# Altium project BCM_ECU.PrjPcb (part 1 of 3)
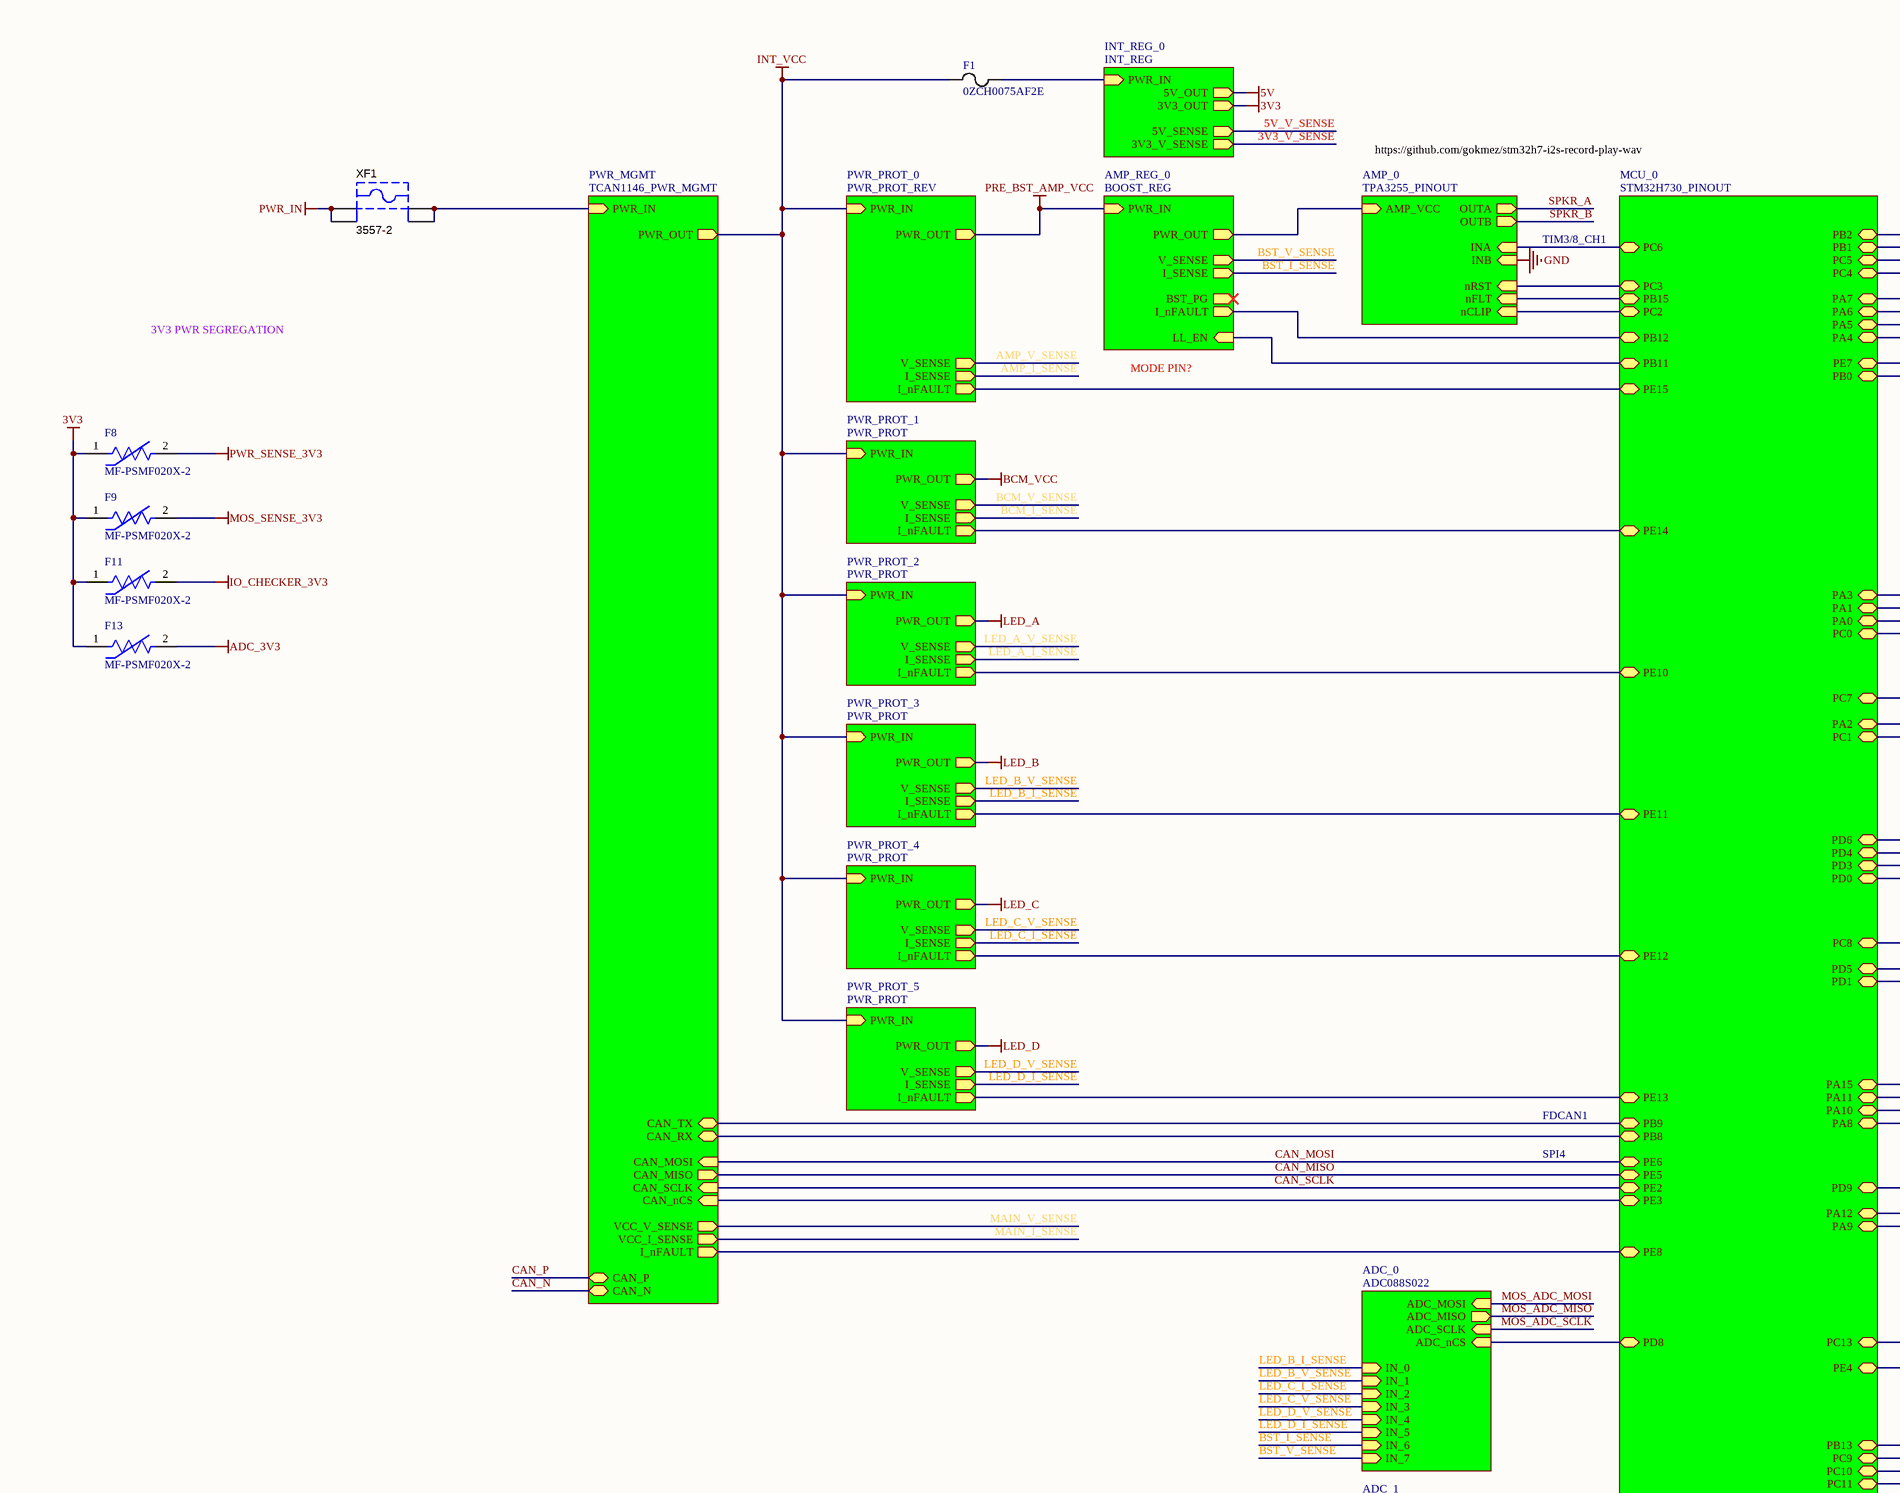
[diagram p0: BCM_ECU.SchDoc, top left]
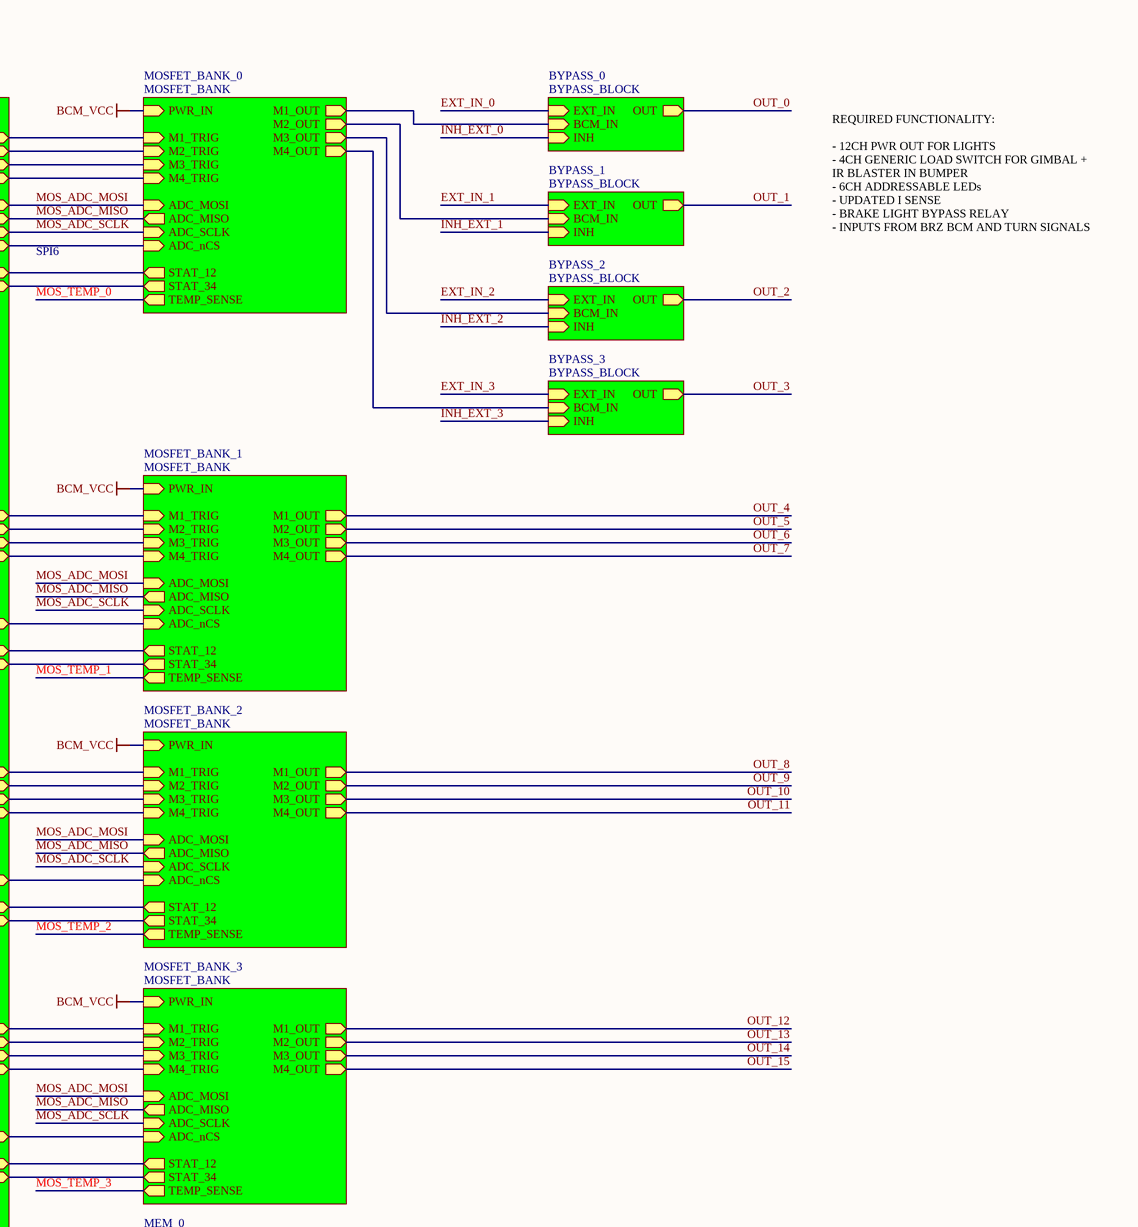
[diagram p1: BCM_ECU.SchDoc, top right]
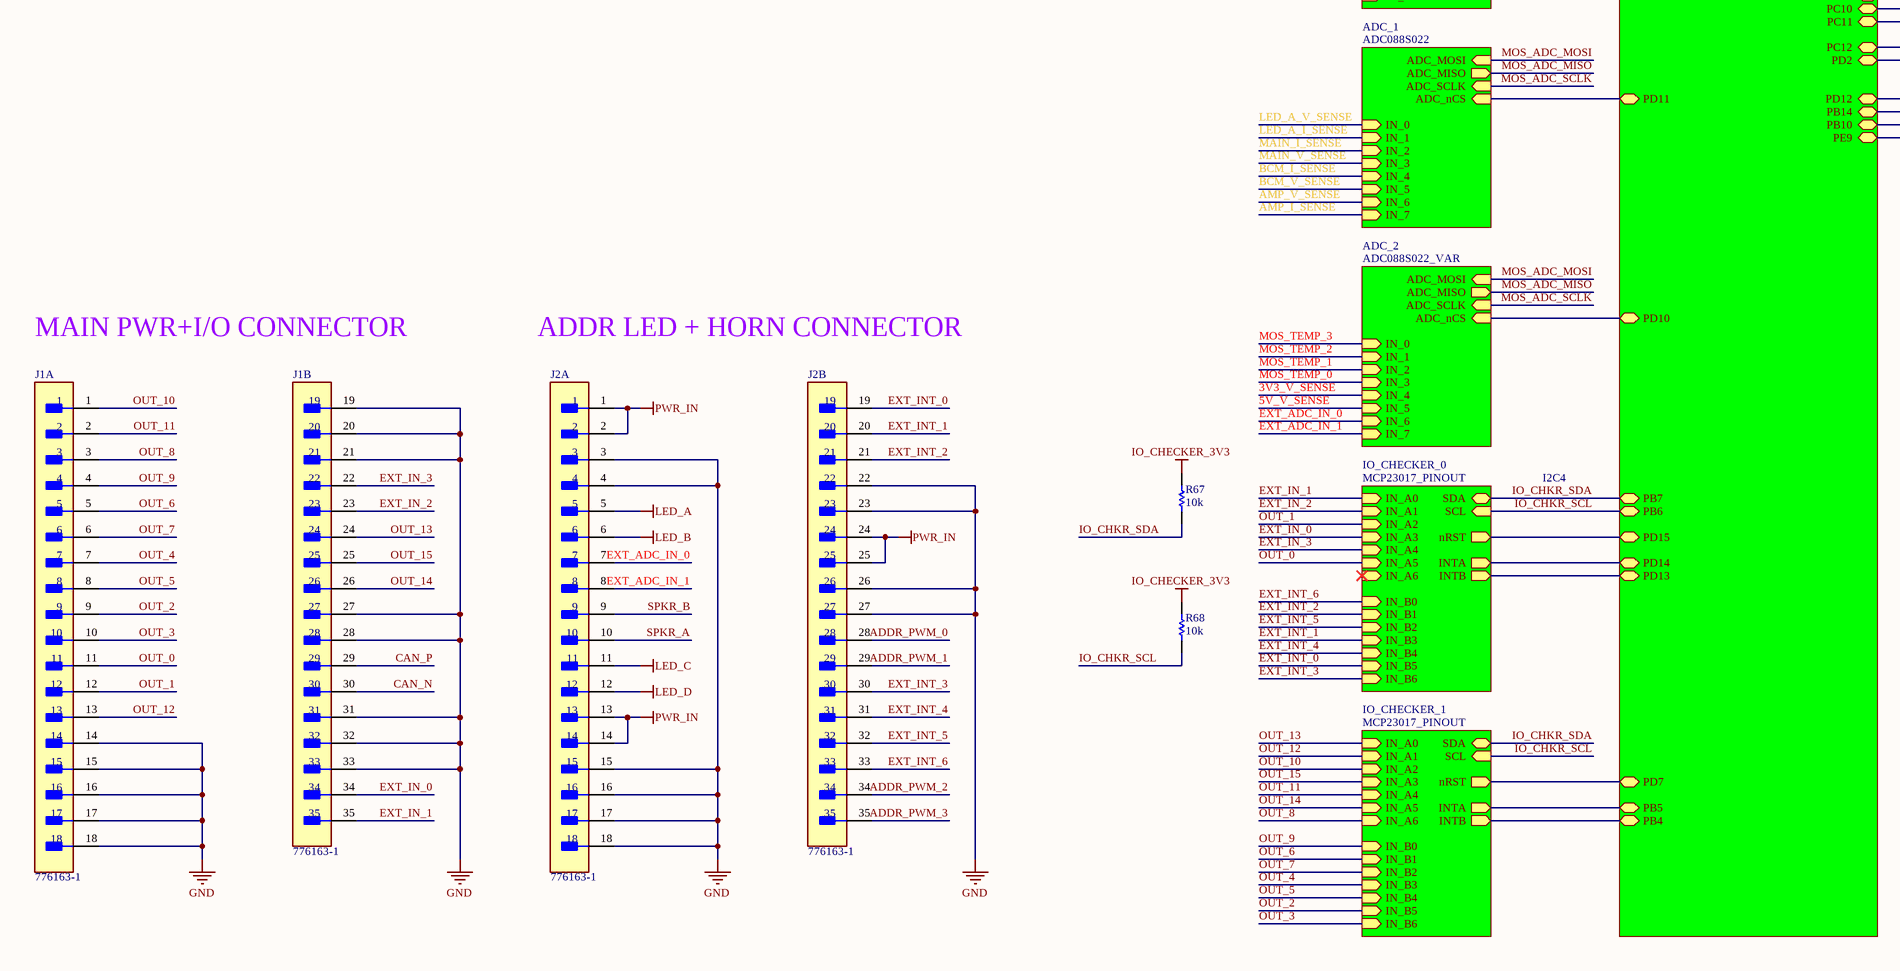
[diagram p2: BCM_ECU.SchDoc, bottom left]
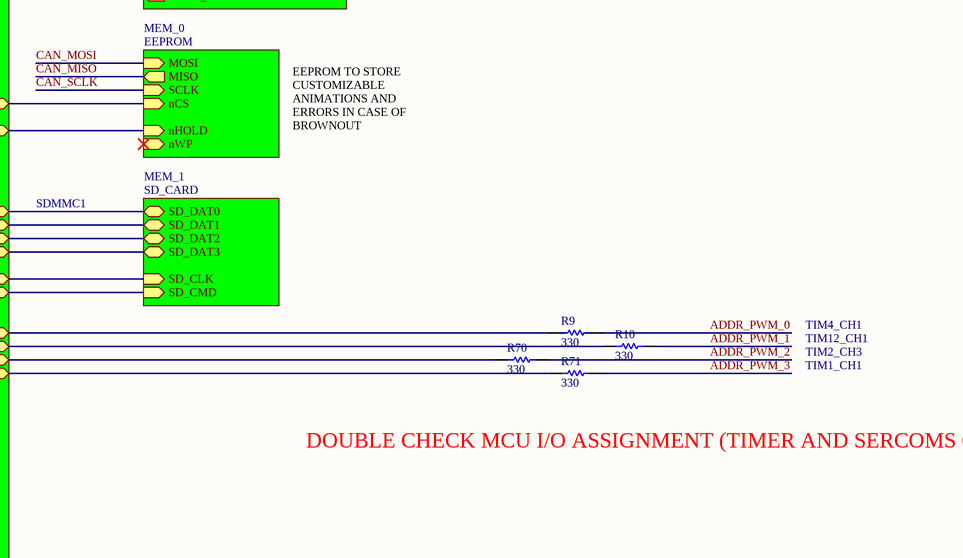
[diagram p3: BCM_ECU.SchDoc, bottom right]
15 sheets, 580 parts. Net scope: hierarchical (ports join the sheet entries above them; power ports are global).
Board files: BCM_ECU_revA.PcbDoc, BCM_ECU_revA_V2.PcbDoc, BCM_ECU_revA_V3.PcbDoc
Sheets:
  BCM_ECU.SchDoc
    MCU_0 = STM32H730_PINOUT.SchDoc
    PWR_MGMT = TCAN1146_PWR_MGMT.SchDoc
    MOSFET_BANK_0 = MOSFET_BANK.SchDoc
    MOSFET_BANK_1 = MOSFET_BANK.SchDoc
    MOSFET_BANK_2 = MOSFET_BANK.SchDoc
    ADC_0 = ADC088S022.SchDoc
    BYPASS_0 = BYPASS_BLOCK.SchDoc
    MOSFET_BANK_3 = MOSFET_BANK.SchDoc
    BYPASS_1 = BYPASS_BLOCK.SchDoc
    BYPASS_2 = BYPASS_BLOCK.SchDoc
    BYPASS_3 = BYPASS_BLOCK.SchDoc
    AMP_REG_0 = BOOST_REG.SchDoc
    INT_REG_0 = INT_REG.SchDoc
    MEM_0 = EEPROM.SchDoc
    PWR_PROT_0 = PWR_PROT_REV.SchDoc
    PWR_PROT_1 = PWR_PROT.SchDoc
    PWR_PROT_2 = PWR_PROT.SchDoc
    PWR_PROT_3 = PWR_PROT.SchDoc
    PWR_PROT_4 = PWR_PROT.SchDoc
    PWR_PROT_5 = PWR_PROT.SchDoc
    ADC_1 = ADC088S022.SchDoc
    IO_CHECKER_0 = MCP23017_PINOUT.SchDoc
    IO_CHECKER_1 = MCP23017_PINOUT.SchDoc
    AMP_0 = TPA3255_PINOUT.SchDoc
    MEM_1 = SD_CARD.SchDoc
    ADC_2 = ADC088S022_VAR.SchDoc

## Sheet BCM_ECU.SchDoc
size D; SheetNumber: 1; SheetTotal: 15

### Parts
F1  0ZCH0075AF2E  [0ZCH0075AF2E-Footprint-1]
F8  MF-PSMF020X-2  [FP-MF-PSMF-MFG]
F9  MF-PSMF020X-2  [FP-MF-PSMF-MFG]
F11  MF-PSMF020X-2  [FP-MF-PSMF-MFG]
F13  MF-PSMF020X-2  [FP-MF-PSMF-MFG]
J1  776163-1  [FP-776163-1-MFG]  (parts A,B of 2)
J2  776163-1  [FP-776163-1-MFG]  (parts A,B of 2)
R9  330  [R0603B]
R10  330  [R0603B]
R67  10k  [R0603B]
R68  10k  [R0603B]
R70  330  [R0603B]
R71  330  [R0603B]
XF1  3557-2  [KSTN-3557-2]

### Sub-sheets
ADC_0 = ADC088S022: IN_0 (in), IN_1 (in), IN_2 (in), IN_3 (in), IN_4 (in), IN_5 (in), IN_6 (in), IN_7 (in), ADC_MOSI (in), ADC_MISO (out), ADC_SCLK (in), ADC_nCS (in)
ADC_1 = ADC088S022: IN_0 (in), IN_1 (in), IN_2 (in), IN_3 (in), IN_4 (in), IN_5 (in), IN_6 (in), IN_7 (in), ADC_MOSI (in), ADC_MISO (out), ADC_SCLK (in), ADC_nCS (in)
ADC_2 = ADC088S022_VAR: IN_0 (in), IN_1 (in), IN_2 (in), IN_3 (in), IN_4 (in), IN_5 (in), IN_6 (in), IN_7 (in), ADC_MOSI (in), ADC_MISO (out), ADC_SCLK (in), ADC_nCS (in)
AMP_0 = TPA3255_PINOUT: INA (in), nRST (in), nCLIP (in), nFLT (in), OUTA (out), OUTB (out), AMP_VCC (in), INB (in)
AMP_REG_0 = BOOST_REG: PWR_IN (in), PWR_OUT (out), I_SENSE (out), V_SENSE (out), I_nFAULT (out), LL_EN (in), BST_PG (out)
BYPASS_0 = BYPASS_BLOCK: EXT_IN (in), OUT (out), INH (in), BCM_IN (in)
BYPASS_1 = BYPASS_BLOCK: EXT_IN (in), OUT (out), INH (in), BCM_IN (in)
BYPASS_2 = BYPASS_BLOCK: EXT_IN (in), OUT (out), INH (in), BCM_IN (in)
BYPASS_3 = BYPASS_BLOCK: EXT_IN (in), OUT (out), INH (in), BCM_IN (in)
INT_REG_0 = INT_REG: PWR_IN (in), 3V3_OUT (out), 3V3_V_SENSE (out), 5V_SENSE (out), 5V_OUT (out)
IO_CHECKER_0 = MCP23017_PINOUT: IN_A0 (in), IN_A1 (in), IN_A2 (in), IN_A3 (in), IN_A4 (in), IN_A5 (in), IN_A6 (in), IN_B0 (in), IN_B1 (in), IN_B2 (in), IN_B3 (in), IN_B4 (in), IN_B5 (in), IN_B6 (in), SDA (bidir), SCL (in), nRST (out), INTA (out), INTB (out)
IO_CHECKER_1 = MCP23017_PINOUT: IN_A0 (in), IN_A1 (in), IN_A2 (in), IN_A3 (in), IN_A4 (in), IN_A5 (in), IN_A6 (in), IN_B0 (in), IN_B1 (in), IN_B2 (in), IN_B3 (in), IN_B4 (in), IN_B5 (in), IN_B6 (in), SDA (bidir), SCL (in), nRST (out), INTA (out), INTB (out)
MCU_0 = STM32H730_PINOUT: PB13 (bidir), PC9 (bidir), PC10 (bidir), PC11 (bidir), PC12 (bidir), PD2 (bidir), PA5 (bidir), PA6 (bidir), PA7 (bidir), PB6 (bidir), PB7 (bidir), PE2 (bidir), PE5 (bidir), PE6 (bidir), PB8 (bidir), PB9 (bidir), PB5 (bidir), PB4 (bidir), PD7 (bidir), PD6 (bidir), PD5 (bidir), PD4 (bidir), PD3 (bidir), PD1 (bidir), PD0 (bidir), PA15 (bidir), PA12 (bidir), PA11 (bidir), PA10 (bidir), PA9 (bidir), PA8 (bidir), PE3 (bidir), PE4 (bidir), PC13 (bidir), PC0 (bidir), PC1 (bidir), PA0 (bidir), PA1 (bidir), PA2 (bidir), PA3 (bidir), PC8 (bidir), PC7 (bidir), PC6 (bidir), PA4 (bidir), PC4 (bidir), PC5 (bidir), PB0 (bidir), PB1 (bidir), PB2 (bidir), PE7 (bidir), PD15 (bidir), PD14 (bidir), PD13 (bidir), PD11 (bidir), PD10 (bidir), PD8 (bidir), PE8 (bidir), PE10 (bidir), PE11 (bidir), PE12 (bidir), PE13 (bidir), PE14 (bidir), PD12 (bidir), PB14 (bidir), PB10 (bidir), PE9 (bidir), PE15 (bidir), PB11 (bidir), PD9 (bidir), PB12 (bidir), PB15 (bidir), PC2 (bidir), PC3 (bidir)
MEM_0 = EEPROM: MOSI (in), MISO (out), SCLK (in), nCS (in), nHOLD (in), nWP (in)
MEM_1 = SD_CARD: SD_DAT0 (bidir), SD_DAT1 (bidir), SD_DAT3 (bidir), SD_DAT2 (bidir), SD_CLK (in), SD_CMD (in)
MOSFET_BANK_0 = MOSFET_BANK: M1_OUT (out), M2_OUT (out), M3_OUT (out), M4_OUT (out), M1_TRIG (in), M2_TRIG (in), M3_TRIG (in), M4_TRIG (in), STAT_12 (out), STAT_34 (out), ADC_MOSI (in), ADC_MISO (out), ADC_SCLK (in), ADC_nCS (in), TEMP_SENSE (out), PWR_IN (in)
MOSFET_BANK_1 = MOSFET_BANK: M1_OUT (out), M2_OUT (out), M3_OUT (out), M4_OUT (out), M1_TRIG (in), M2_TRIG (in), M3_TRIG (in), M4_TRIG (in), STAT_12 (out), STAT_34 (out), ADC_MOSI (in), ADC_MISO (out), ADC_SCLK (in), ADC_nCS (in), TEMP_SENSE (out), PWR_IN (in)
MOSFET_BANK_2 = MOSFET_BANK: M1_OUT (out), M2_OUT (out), M3_OUT (out), M4_OUT (out), M1_TRIG (in), M2_TRIG (in), M3_TRIG (in), M4_TRIG (in), STAT_12 (out), STAT_34 (out), ADC_MOSI (in), ADC_MISO (out), ADC_SCLK (in), ADC_nCS (in), TEMP_SENSE (out), PWR_IN (in)
MOSFET_BANK_3 = MOSFET_BANK: M1_OUT (out), M2_OUT (out), M3_OUT (out), M4_OUT (out), M1_TRIG (in), M2_TRIG (in), M3_TRIG (in), M4_TRIG (in), STAT_12 (out), STAT_34 (out), ADC_MOSI (in), ADC_MISO (out), ADC_SCLK (in), ADC_nCS (in), TEMP_SENSE (out), PWR_IN (in)
PWR_MGMT = TCAN1146_PWR_MGMT: PWR_IN (in), PWR_OUT (out), CAN_TX (bidir), CAN_RX (bidir), CAN_MOSI (in), CAN_MISO (out), CAN_SCLK (in), CAN_nCS (in), VCC_V_SENSE (out), VCC_I_SENSE (out), I_nFAULT (out), CAN_P (bidir), CAN_N (bidir)
PWR_PROT_0 = PWR_PROT_REV: PWR_IN (in), PWR_OUT (out), V_SENSE (out), I_SENSE (out), I_nFAULT (out)
PWR_PROT_1 = PWR_PROT: PWR_IN (in), PWR_OUT (out), V_SENSE (out), I_SENSE (out), I_nFAULT (out)
PWR_PROT_2 = PWR_PROT: PWR_IN (in), PWR_OUT (out), V_SENSE (out), I_SENSE (out), I_nFAULT (out)
PWR_PROT_3 = PWR_PROT: PWR_IN (in), PWR_OUT (out), V_SENSE (out), I_SENSE (out), I_nFAULT (out)
PWR_PROT_4 = PWR_PROT: PWR_IN (in), PWR_OUT (out), V_SENSE (out), I_SENSE (out), I_nFAULT (out)
PWR_PROT_5 = PWR_PROT: PWR_IN (in), PWR_OUT (out), V_SENSE (out), I_SENSE (out), I_nFAULT (out)

### Nets
3V3: F8.1 F9.1 F11.1 F13.1 ; sheet INT_REG_0/3V3_OUT
ADC_3V3: F13.2
BCM_VCC: sheet MOSFET_BANK_0/PWR_IN, sheet MOSFET_BANK_1/PWR_IN, sheet MOSFET_BANK_2/PWR_IN, sheet MOSFET_BANK_3/PWR_IN, sheet PWR_PROT_1/PWR_OUT
GND: J1.14 J1.15 J1.16 J1.17 J1.18 J1.19 J1.20 J1.21 J1.27 J1.28 J1.31 J1.32 J1.33 J2.3 J2.4 J2.15 J2.16 J2.17 J2.18 J2.22 J2.23 J2.26 J2.27 ; sheet AMP_0/INB
INT_VCC: F1.1 ; sheet PWR_MGMT/PWR_OUT, sheet PWR_PROT_0/PWR_IN, sheet PWR_PROT_1/PWR_IN, sheet PWR_PROT_2/PWR_IN, sheet PWR_PROT_3/PWR_IN, sheet PWR_PROT_4/PWR_IN, sheet PWR_PROT_5/PWR_IN  [project net PWR_OUT]
IO_CHECKER_3V3: F11.2 R67.2 R68.2
LED_A: J2.5 ; sheet PWR_PROT_2/PWR_OUT
LED_B: J2.6 ; sheet PWR_PROT_3/PWR_OUT
LED_C: J2.11 ; sheet PWR_PROT_4/PWR_OUT
LED_D: J2.12 ; sheet PWR_PROT_5/PWR_OUT
MOS_SENSE_3V3: F9.2
PRE_BST_AMP_VCC: sheet AMP_REG_0/PWR_IN, sheet PWR_PROT_0/PWR_OUT
PWR_IN: J2.1 J2.2 J2.13 J2.14 J2.24 J2.25 XF1.1 XF1.2
PWR_SENSE_3V3: F8.2
3V3_V_SENSE: sheet INT_REG_0/3V3_V_SENSE, sheet ADC_2/IN_4
5V_V_SENSE: sheet INT_REG_0/5V_SENSE, sheet ADC_2/IN_5
ADC_nCS: sheet MCU_0/PC7, sheet MOSFET_BANK_1/ADC_nCS
ADC_nCS: sheet MCU_0/PC8, sheet MOSFET_BANK_2/ADC_nCS  [a separate net that carries the same name]
ADC_nCS: sheet MCU_0/PA4, sheet MOSFET_BANK_0/ADC_nCS  [a separate net that carries the same name]
ADC_nCS: sheet MCU_0/PD9, sheet MOSFET_BANK_3/ADC_nCS  [a separate net that carries the same name]
ADDR_PWM_0: J2.28 R9.1
ADDR_PWM_1: J2.29 R10.1
ADDR_PWM_2: J2.34 R70.1
ADDR_PWM_3: J2.35 R71.1
AMP_I_SENSE: sheet PWR_PROT_0/I_SENSE, sheet ADC_1/IN_7
AMP_V_SENSE: sheet PWR_PROT_0/V_SENSE, sheet ADC_1/IN_6
AMP_VCC: sheet AMP_REG_0/PWR_OUT, sheet AMP_0/AMP_VCC
BCM_I_SENSE: sheet PWR_PROT_1/I_SENSE, sheet ADC_1/IN_4
BCM_V_SENSE: sheet PWR_PROT_1/V_SENSE, sheet ADC_1/IN_5
BST_I_SENSE: sheet ADC_0/IN_6, sheet AMP_REG_0/I_SENSE
BST_V_SENSE: sheet ADC_0/IN_7, sheet AMP_REG_0/V_SENSE
CAN_MISO: sheet MCU_0/PE5, sheet PWR_MGMT/CAN_MISO, sheet MEM_0/MISO
CAN_MOSI: sheet MCU_0/PE6, sheet PWR_MGMT/CAN_MOSI, sheet MEM_0/MOSI
CAN_N: J1.30 ; sheet PWR_MGMT/CAN_N
CAN_nCS: sheet MCU_0/PE3, sheet PWR_MGMT/CAN_nCS
CAN_P: J1.29 ; sheet PWR_MGMT/CAN_P
CAN_RX: sheet MCU_0/PB8, sheet PWR_MGMT/CAN_RX
CAN_SCLK: sheet MCU_0/PE2, sheet PWR_MGMT/CAN_SCLK, sheet MEM_0/SCLK
CAN_TX: sheet MCU_0/PB9, sheet PWR_MGMT/CAN_TX
EXT_ADC_IN_0: J2.7 ; sheet ADC_2/IN_6
EXT_ADC_IN_1: J2.8 ; sheet ADC_2/IN_7
EXT_IN_0: J1.34 ; sheet BYPASS_0/EXT_IN, sheet IO_CHECKER_0/IN_A3
EXT_IN_1: J1.35 ; sheet BYPASS_1/EXT_IN, sheet IO_CHECKER_0/IN_A0
EXT_IN_2: J1.23 ; sheet BYPASS_2/EXT_IN, sheet IO_CHECKER_0/IN_A1
EXT_IN_3: J1.22 ; sheet BYPASS_3/EXT_IN, sheet IO_CHECKER_0/IN_A4
EXT_INT_0: J2.19 ; sheet IO_CHECKER_0/IN_B5
EXT_INT_1: J2.20 ; sheet IO_CHECKER_0/IN_B3
EXT_INT_2: J2.21 ; sheet IO_CHECKER_0/IN_B1
EXT_INT_3: J2.30 ; sheet IO_CHECKER_0/IN_B6
EXT_INT_4: J2.31 ; sheet IO_CHECKER_0/IN_B4
EXT_INT_5: J2.32 ; sheet IO_CHECKER_0/IN_B2
EXT_INT_6: J2.33 ; sheet IO_CHECKER_0/IN_B0
IO_CHKR_SCL: R68.1 ; sheet MCU_0/PB6, sheet IO_CHECKER_0/SCL, sheet IO_CHECKER_1/SCL
IO_CHKR_SDA: R67.1 ; sheet MCU_0/PB7, sheet IO_CHECKER_0/SDA, sheet IO_CHECKER_1/SDA
LED_A_I_SENSE: sheet PWR_PROT_2/I_SENSE, sheet ADC_1/IN_1
LED_A_V_SENSE: sheet PWR_PROT_2/V_SENSE, sheet ADC_1/IN_0
LED_B_I_SENSE: sheet ADC_0/IN_0, sheet PWR_PROT_3/I_SENSE
LED_B_V_SENSE: sheet ADC_0/IN_1, sheet PWR_PROT_3/V_SENSE
LED_C_I_SENSE: sheet ADC_0/IN_2, sheet PWR_PROT_4/I_SENSE
LED_C_V_SENSE: sheet ADC_0/IN_3, sheet PWR_PROT_4/V_SENSE
LED_D_I_SENSE: sheet ADC_0/IN_5, sheet PWR_PROT_5/I_SENSE
LED_D_V_SENSE: sheet ADC_0/IN_4, sheet PWR_PROT_5/V_SENSE
MAIN_I_SENSE: sheet PWR_MGMT/VCC_I_SENSE, sheet ADC_1/IN_2
MAIN_V_SENSE: sheet PWR_MGMT/VCC_V_SENSE, sheet ADC_1/IN_3
MOS_ADC_MISO: sheet MCU_0/PA6, sheet MOSFET_BANK_0/ADC_MISO, sheet MOSFET_BANK_1/ADC_MISO, sheet MOSFET_BANK_2/ADC_MISO, sheet ADC_0/ADC_MISO, sheet MOSFET_BANK_3/ADC_MISO, sheet ADC_1/ADC_MISO, sheet ADC_2/ADC_MISO  [project net ADC_MISO]
MOS_ADC_MOSI: sheet MCU_0/PA7, sheet MOSFET_BANK_0/ADC_MOSI, sheet MOSFET_BANK_1/ADC_MOSI, sheet MOSFET_BANK_2/ADC_MOSI, sheet ADC_0/ADC_MOSI, sheet MOSFET_BANK_3/ADC_MOSI, sheet ADC_1/ADC_MOSI, sheet ADC_2/ADC_MOSI  [project net ADC_MOSI]
MOS_ADC_SCLK: sheet MCU_0/PA5, sheet MOSFET_BANK_0/ADC_SCLK, sheet MOSFET_BANK_1/ADC_SCLK, sheet MOSFET_BANK_2/ADC_SCLK, sheet ADC_0/ADC_SCLK, sheet MOSFET_BANK_3/ADC_SCLK, sheet ADC_1/ADC_SCLK, sheet ADC_2/ADC_SCLK  [project net ADC_SCLK]
MOS_TEMP_0: sheet MOSFET_BANK_0/TEMP_SENSE, sheet ADC_2/IN_3
MOS_TEMP_1: sheet MOSFET_BANK_1/TEMP_SENSE, sheet ADC_2/IN_2
MOS_TEMP_2: sheet MOSFET_BANK_2/TEMP_SENSE, sheet ADC_2/IN_1
MOS_TEMP_3: sheet MOSFET_BANK_3/TEMP_SENSE, sheet ADC_2/IN_0
OUT_0: J1.11 ; sheet MOSFET_BANK_0/M1_OUT, sheet BYPASS_0/OUT, sheet BYPASS_0/BCM_IN, sheet IO_CHECKER_0/IN_A5
OUT_1: J1.12 ; sheet MOSFET_BANK_0/M2_OUT, sheet BYPASS_1/OUT, sheet BYPASS_1/BCM_IN, sheet IO_CHECKER_0/IN_A2
OUT_2: J1.9 ; sheet MOSFET_BANK_0/M3_OUT, sheet BYPASS_2/OUT, sheet BYPASS_2/BCM_IN, sheet IO_CHECKER_1/IN_B5
OUT_3: J1.10 ; sheet MOSFET_BANK_0/M4_OUT, sheet BYPASS_3/OUT, sheet BYPASS_3/BCM_IN, sheet IO_CHECKER_1/IN_B6
OUT_4: J1.7 ; sheet MOSFET_BANK_1/M1_OUT, sheet IO_CHECKER_1/IN_B3
OUT_5: J1.8 ; sheet MOSFET_BANK_1/M2_OUT, sheet IO_CHECKER_1/IN_B4
OUT_6: J1.5 ; sheet MOSFET_BANK_1/M3_OUT, sheet IO_CHECKER_1/IN_B1
OUT_7: J1.6 ; sheet MOSFET_BANK_1/M4_OUT, sheet IO_CHECKER_1/IN_B2
OUT_8: J1.3 ; sheet MOSFET_BANK_2/M1_OUT, sheet IO_CHECKER_1/IN_A6
OUT_9: J1.4 ; sheet MOSFET_BANK_2/M2_OUT, sheet IO_CHECKER_1/IN_B0
OUT_10: J1.1 ; sheet MOSFET_BANK_2/M3_OUT, sheet IO_CHECKER_1/IN_A2
OUT_11: J1.2 ; sheet MOSFET_BANK_2/M4_OUT, sheet IO_CHECKER_1/IN_A4
OUT_12: J1.13 ; sheet MOSFET_BANK_3/M1_OUT, sheet IO_CHECKER_1/IN_A1
OUT_13: J1.24 ; sheet MOSFET_BANK_3/M2_OUT, sheet IO_CHECKER_1/IN_A0
OUT_14: J1.26 ; sheet MOSFET_BANK_3/M3_OUT, sheet IO_CHECKER_1/IN_A5
OUT_15: J1.25 ; sheet MOSFET_BANK_3/M4_OUT, sheet IO_CHECKER_1/IN_A3
SD_CLK: sheet MCU_0/PC12, sheet MEM_1/SD_CLK
SD_CMD: sheet MCU_0/PD2, sheet MEM_1/SD_CMD
SD_DAT0: sheet MCU_0/PB13, sheet MEM_1/SD_DAT0
SD_DAT1: sheet MCU_0/PC9, sheet MEM_1/SD_DAT1
SD_DAT2: sheet MCU_0/PC10, sheet MEM_1/SD_DAT2
SD_DAT3: sheet MCU_0/PC11, sheet MEM_1/SD_DAT3
SPKR_A: J2.10 ; sheet AMP_0/OUTA
SPKR_B: J2.9 ; sheet AMP_0/OUTB
NetC16_1: F1.2 ; sheet INT_REG_0/PWR_IN
NetC44_2: sheet MCU_0/PC6, sheet AMP_0/INA
NetQ1_5-6-7-8: XF1.3 XF1.4 ; sheet PWR_MGMT/PWR_IN
NetR1_MOSFET_BANK_0_1: sheet MCU_0/PB2, sheet MOSFET_BANK_0/M1_TRIG
NetR1_MOSFET_BANK_1_1: sheet MCU_0/PA3, sheet MOSFET_BANK_1/M1_TRIG
NetR1_MOSFET_BANK_2_1: sheet MCU_0/PD6, sheet MOSFET_BANK_2/M1_TRIG
NetR1_MOSFET_BANK_3_1: sheet MCU_0/PA15, sheet MOSFET_BANK_3/M1_TRIG
NetR2_MOSFET_BANK_0_1: sheet MCU_0/PB1, sheet MOSFET_BANK_0/M2_TRIG
NetR2_MOSFET_BANK_1_1: sheet MCU_0/PA1, sheet MOSFET_BANK_1/M2_TRIG
NetR2_MOSFET_BANK_2_1: sheet MCU_0/PD4, sheet MOSFET_BANK_2/M2_TRIG
NetR2_MOSFET_BANK_3_1: sheet MCU_0/PA11, sheet MOSFET_BANK_3/M2_TRIG
NetR3_MOSFET_BANK_0_1: sheet MCU_0/PC5, sheet MOSFET_BANK_0/M3_TRIG
NetR3_MOSFET_BANK_1_1: sheet MCU_0/PA0, sheet MOSFET_BANK_1/M3_TRIG
NetR3_MOSFET_BANK_2_1: sheet MCU_0/PD3, sheet MOSFET_BANK_2/M3_TRIG
NetR3_MOSFET_BANK_3_1: sheet MCU_0/PA10, sheet MOSFET_BANK_3/M3_TRIG
NetR4_MOSFET_BANK_0_1: sheet MCU_0/PC4, sheet MOSFET_BANK_0/M4_TRIG
NetR4_MOSFET_BANK_1_1: sheet MCU_0/PC0, sheet MOSFET_BANK_1/M4_TRIG
NetR4_MOSFET_BANK_2_1: sheet MCU_0/PD0, sheet MOSFET_BANK_2/M4_TRIG
NetR4_MOSFET_BANK_3_1: sheet MCU_0/PA8, sheet MOSFET_BANK_3/M4_TRIG
NetR5_MOSFET_BANK_0_1: sheet MCU_0/PE7, sheet MOSFET_BANK_0/STAT_12
NetR5_MOSFET_BANK_1_1: sheet MCU_0/PA2, sheet MOSFET_BANK_1/STAT_12
NetR5_MOSFET_BANK_2_1: sheet MCU_0/PD5, sheet MOSFET_BANK_2/STAT_12
NetR5_MOSFET_BANK_3_1: sheet MCU_0/PA12, sheet MOSFET_BANK_3/STAT_12
NetR6_MOSFET_BANK_0_1: sheet MCU_0/PB0, sheet MOSFET_BANK_0/STAT_34
NetR6_MOSFET_BANK_1_1: sheet MCU_0/PC1, sheet MOSFET_BANK_1/STAT_34
NetR6_MOSFET_BANK_2_1: sheet MCU_0/PD1, sheet MOSFET_BANK_2/STAT_34
NetR6_MOSFET_BANK_3_1: sheet MCU_0/PA9, sheet MOSFET_BANK_3/STAT_34
NetR9_2: R9.2 ; sheet MCU_0/PD12
NetR10_2: R10.2 ; sheet MCU_0/PB14
NetR26_1: sheet MCU_0/PE8, sheet PWR_MGMT/I_nFAULT
NetR36_1: sheet MCU_0/PE4, sheet MEM_0/nHOLD
NetR50_PWR_PROT_1_2: sheet MCU_0/PE14, sheet PWR_PROT_1/I_nFAULT
NetR50_PWR_PROT_2_2: sheet MCU_0/PE10, sheet PWR_PROT_2/I_nFAULT
NetR50_PWR_PROT_3_2: sheet MCU_0/PE11, sheet PWR_PROT_3/I_nFAULT
NetR50_PWR_PROT_4_2: sheet MCU_0/PE12, sheet PWR_PROT_4/I_nFAULT
NetR50_PWR_PROT_5_2: sheet MCU_0/PE13, sheet PWR_PROT_5/I_nFAULT
NetR70_2: R70.2 ; sheet MCU_0/PB10
NetR71_2: R71.2 ; sheet MCU_0/PE9
NetR87_2: sheet MCU_0/PB11, sheet AMP_REG_0/LL_EN
NetR88_2: sheet MCU_0/PB12, sheet AMP_REG_0/I_nFAULT
NetR107_2: sheet MCU_0/PE15, sheet PWR_PROT_0/I_nFAULT
NetR121_IO_CHECKER_0_1: sheet MCU_0/PD15, sheet IO_CHECKER_0/nRST
NetR121_IO_CHECKER_1_1: sheet MCU_0/PD7, sheet IO_CHECKER_1/nRST
NetU10_7: sheet MCU_0/PC13, sheet MEM_0/nCS
NetU10_17: sheet MCU_0/PC2, sheet AMP_0/nCLIP
NetU10_18: sheet MCU_0/PC3, sheet AMP_0/nRST
NetU10_54: sheet MCU_0/PB15, sheet AMP_0/nFLT
NetU10_55: sheet MCU_0/PD8, sheet ADC_0/ADC_nCS
NetU10_57: sheet MCU_0/PD10, sheet ADC_2/ADC_nCS
NetU10_58: sheet MCU_0/PD11, sheet ADC_1/ADC_nCS
NetU10_60: sheet MCU_0/PD13, sheet IO_CHECKER_0/INTB
NetU10_61: sheet MCU_0/PD14, sheet IO_CHECKER_0/INTA
NetU10_90: sheet MCU_0/PB4, sheet IO_CHECKER_1/INTB
NetU10_91: sheet MCU_0/PB5, sheet IO_CHECKER_1/INTA

### Notes on the sheet
- https://github.com/gokmez/stm32h7-i2s-record-play-wav
- TIM3/8_CH1
- 3V3 PWR SEGREGATION
- SPI6
- REQUIRED FUNCTIONALITY:
  - 12CH PWR OUT FOR LIGHTS
  - 4CH GENERIC LOAD SWITCH FOR GIMBAL + IR BLASTER IN BUMPER
  - 6CH ADDRESSABLE LEDs
  - UPDATED I SENSE
  - BRAKE LIGHT BYPASS RELAY
  - INPUTS FROM BRZ BCM AND TURN SIGNALS
- MODE PIN?
- FDCAN1
- SPI4
- EEPROM TO STORE CUSTOMIZABLE ANIMATIONS AND ERRORS IN CASE OF BROWNOUT
- SDMMC1
- TIM4_CH1
- TIM12_CH1
- TIM2_CH3
- TIM1_CH1
- DOUBLE CHECK MCU I/O ASSIGNMENT (TIMER AND SERCOMS CORRECT)
- MAIN PWR+I/O CONNECTOR
- ADDR LED + HORN CONNECTOR
- I2C4

### Library data of the parts
F1 = CMP-005-00028-2: PTC Thermistor; RoHS Compliant: Yes
F8 F9 F11 F13 = CMP-07400-000005-1: PTC RESET FUSE 9V 200MA 0805; Manufacturer: Bourns; Trip Current: 0.5A; Resistance: 0.65-3.5Ω; Current Rating: 40A; Value: 0.65-3.5Ω; Trip Time: 0.02s; Hold Current: 0.2A; ComponentLink2Description: Datasheet; Manufacturer Part Number: MF-PSMF020X-2; Height: 0.85mm; Ambient Temperature Range High: +85°C; Category: Fuse; Temperature Range Low: -40°C; ComponentLink2URL: https://www.bourns.com/docs/Product-Datasheets/mfpsmf.pdf; Temperature Range High: +85°C; RoHS: TRUE; Device Class L1: Circuit Protection; Device Class L3: unset; Package: MF-PSMF; Digikey Description: PTC RESET FUSE 9V 200MA 0805; Mouser Description: PTC Resettable Fuse 0.2A(hold) 0.5A(trip) 9V 40A 0.5W 0.02s 0.65Ohm SMD Solder Pad 0805 T/R; Voltage Rating: 9V; Automotive: No; Device Class L2: PTC Resettable Fuses; Temperature: -40°C to +85°C; Lead Free: Yes; Octopart: https://octopart.com/mf-psmf020x-2-bourns-7483437; Ambient Temperature Range Low: -40°C
J1 J2 = CMP-03369-000154-1: CONN HEADER R/A 35POS 4MM; Primary Type: Rectangular; Circuit Application: Power; Tab Thickness: 1.3mm; Number of Signal Positions: 35; Shielding: Unshielded; Pitch: 0.157inch; Max Voltage Rating (AC): 250V; Connector System: Wire-to-Device; Insulation: Insulated; Current Rating: 17A; PCB Thickness: 0.062inch; PCB Mount Retention: With; Gender: Male; Connector Type: Male Pin; PCB Mount Alignment: Yes (With); Series: Ampseal; Depth: 37.9mm; Orientation: Right Angle; Length: 3.03inch; Termination: Solder; Radiation Hardening: No; Number of Rows: 3; Contact Plating: Tin; Lead Free: Lead Free; Flammability Rating: UL94 V-0; Contact Material: Brass; Number of Contacts: 35; ELV: Compliant; Max Operating Temperature: 221°C; Min Operating Temperature: -40°C; Package Quantity: 1; Mount: Through Hole; Contact Type: Male Pin; Housing Material: Thermoplastic; Number of Positions: 35; Packaging: Bulk; Row Spacing: 0.157inch; RoHS Compliant: Yes; Height: 32.1mm; Color: Black; Fastening Type: Ramp; Sealable: Yes (With); Width: 37.9mm
R9 R10 R70 R71 = CMP-009-00002-14: Resistor; Value: 330
R67 R68 = CMP-009-00002-14: Resistor; Value: 100k
XF1 = CMP-2000-05461-1: FUSE HOLDER, PCB MOUNT, 500VAC, 20A, ROHS; Manufacturer: Keystone-Electronics; Number of Circuits: 1; Voltage: 500V; Fuseholder Type: Block; Fuse Type: Blade; Fuse Size: 0.43"Lx0.15"Wx0.64"H(10.92mmx3.81mmx16.25mm); For Use With/Related Products: ATC,ATO257,MINI897; Current Rating: 30A; Datasheet URL: http://datasheet.octopart.com/3557-2-Keystone-datasheet-15715937.pdf; Orientation: Vertical; Family: Fuseholders; Datasheet Version: Apr-13; Contact Finish: TinNickel; Mounting Type: PCB; Series: -; Category: CircuitProtection; Termination Style: PCPin; Contact Material: Brass; Manufacturer URL: http://www.keyelco.com/

## Sheet STM32H730_PINOUT.SchDoc
size C; SheetNumber: 4; SheetTotal: 15
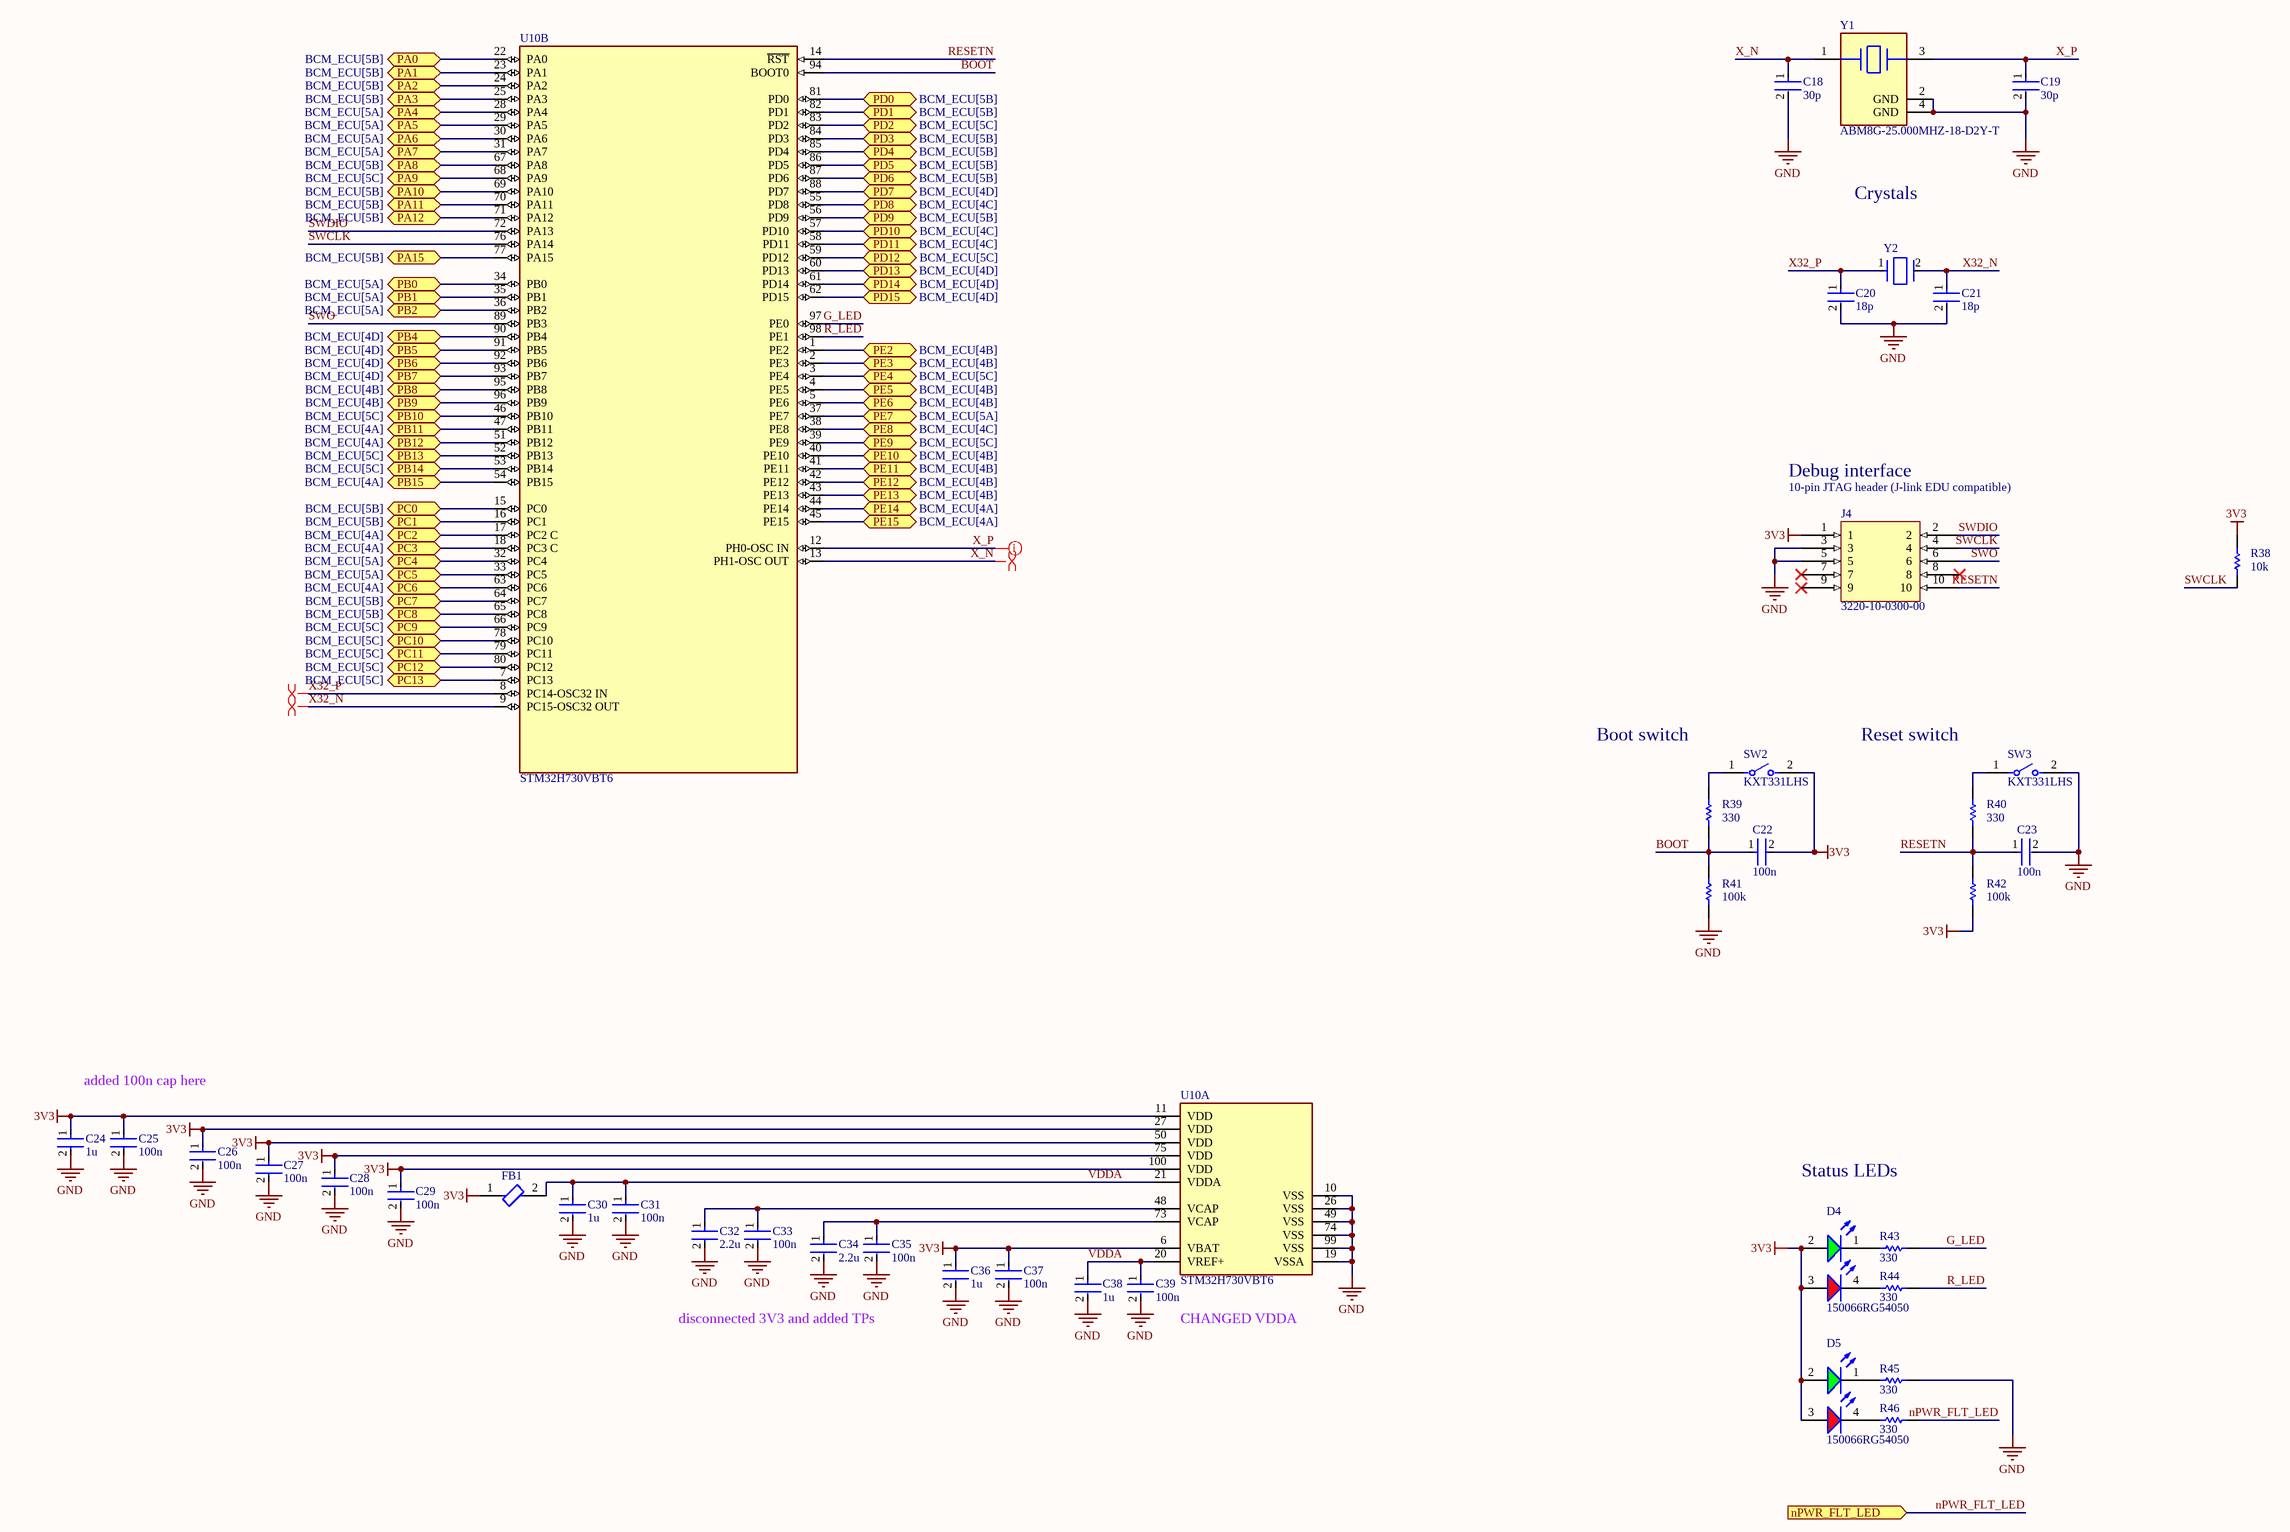
[diagram p4: STM32H730_PINOUT.SchDoc]

### Parts
C18  30p  [FP-0402-L_1_0_0_05-W_0_5-IPC_A]
C19  30p  [FP-0402-L_1_0_0_05-W_0_5-IPC_A]
C20  18p  [FP-0402-L_1_0_0_05-W_0_5-IPC_A]
C21  18p  [FP-0402-L_1_0_0_05-W_0_5-IPC_A]
C22  100n  [FP-0402-L_1_0_0_05-W_0_5-IPC_A]
C23  100n  [FP-0402-L_1_0_0_05-W_0_5-IPC_A]
C24  1u  [FP-0402-L_1_0_0_05-W_0_5-IPC_A]
C25  100n  [FP-0402-L_1_0_0_05-W_0_5-IPC_A]
C26  100n  [FP-0402-L_1_0_0_05-W_0_5-IPC_A]
C27  100n  [FP-0402-L_1_0_0_05-W_0_5-IPC_A]
C28  100n  [FP-0402-L_1_0_0_05-W_0_5-IPC_A]
C29  100n  [FP-0402-L_1_0_0_05-W_0_5-IPC_A]
C30  1u  [FP-0402-L_1_0_0_05-W_0_5-IPC_A]
C31  100n  [FP-0402-L_1_0_0_05-W_0_5-IPC_A]
C32  2.2u  [FP-0402-L_1_0_0_05-W_0_5-IPC_A]
C33  100n  [FP-0402-L_1_0_0_05-W_0_5-IPC_A]
C34  2.2u  [FP-0402-L_1_0_0_05-W_0_5-IPC_A]
C35  100n  [FP-0402-L_1_0_0_05-W_0_5-IPC_A]
C36  1u  [FP-0402-L_1_0_0_05-W_0_5-IPC_A]
C37  100n  [FP-0402-L_1_0_0_05-W_0_5-IPC_A]
C38  1u  [FP-0402-L_1_0_0_05-W_0_5-IPC_A]
C39  100n  [FP-0402-L_1_0_0_05-W_0_5-IPC_A]
D4  150066RG54050  [WL-SBCD_0606]
D5  150066RG54050  [WL-SBCD_0606]
FB1  BLM15PX601SN1D  [FP-BLM15-0_05-IPC_A]  (value not drawn)
J4  3220-10-0300-00  [3220-10-0300-00-Footprint-1]
R38  10k  [R0603B]
R39  330  [R0603B]
R40  330  [R0603B]
R41  100k  [R0603B]
R42  100k  [R0603B]
R43  330  [R0603B]
R44  330  [R0603B]
R45  330  [R0603B]
R46  330  [R0603B]
SW2  KXT331LHS  [FP-KXT331LHS-MFG]
SW3  KXT331LHS  [FP-KXT331LHS-MFG]
U10  STM32H730VBT6  [FP-LQFP100-1L-IPC_C]  (parts A,B of 2)
Y1  ABM8G-25.000MHZ-18-D2Y-T  [FP-ABM8G-MFG]
Y2  ECS-.327-12.5-1210-TR  [FP-ECX-1210-MFG]  (value not drawn)

### Ports
nPWR_FLT_LED (in), PA0 (bidir, see BCM_ECU[5B]), PA1 (bidir, see BCM_ECU[5B]), PA2 (bidir, see BCM_ECU[5B]), PA3 (bidir, see BCM_ECU[5B]), PA4 (bidir, see BCM_ECU[5A]), PA5 (bidir, see BCM_ECU[5A]), PA6 (bidir, see BCM_ECU[5A]), PA7 (bidir, see BCM_ECU[5A]), PA8 (bidir, see BCM_ECU[5B]), PA9 (bidir, see BCM_ECU[5C]), PA10 (bidir, see BCM_ECU[5B]), PA11 (bidir, see BCM_ECU[5B]), PA12 (bidir, see BCM_ECU[5B]), PA15 (bidir, see BCM_ECU[5B]), PB0 (bidir, see BCM_ECU[5A]), PB1 (bidir, see BCM_ECU[5A]), PB2 (bidir, see BCM_ECU[5A]), PB4 (bidir, see BCM_ECU[4D]), PB5 (bidir, see BCM_ECU[4D]), PB6 (bidir, see BCM_ECU[4D]), PB7 (bidir, see BCM_ECU[4D]), PB8 (bidir, see BCM_ECU[4B]), PB9 (bidir, see BCM_ECU[4B]), PB10 (bidir, see BCM_ECU[5C]), PB11 (bidir, see BCM_ECU[4A]), PB12 (bidir, see BCM_ECU[4A]), PB13 (bidir, see BCM_ECU[5C]), PB14 (bidir, see BCM_ECU[5C]), PB15 (bidir, see BCM_ECU[4A]), PC0 (bidir, see BCM_ECU[5B]), PC1 (bidir, see BCM_ECU[5B]), PC2 (bidir, see BCM_ECU[4A]), PC3 (bidir, see BCM_ECU[4A]), PC4 (bidir, see BCM_ECU[5A]), PC5 (bidir, see BCM_ECU[5A]), PC6 (bidir, see BCM_ECU[4A]), PC7 (bidir, see BCM_ECU[5B]), PC8 (bidir, see BCM_ECU[5B]), PC9 (bidir, see BCM_ECU[5C]), PC10 (bidir, see BCM_ECU[5C]), PC11 (bidir, see BCM_ECU[5C]), PC12 (bidir, see BCM_ECU[5C]), PC13 (bidir, see BCM_ECU[5C]), PD0 (bidir, see BCM_ECU[5B]), PD1 (bidir, see BCM_ECU[5B]), PD2 (bidir, see BCM_ECU[5C]), PD3 (bidir, see BCM_ECU[5B]), PD4 (bidir, see BCM_ECU[5B]), PD5 (bidir, see BCM_ECU[5B]), PD6 (bidir, see BCM_ECU[5B]), PD7 (bidir, see BCM_ECU[4D]), PD8 (bidir, see BCM_ECU[4C]), PD9 (bidir, see BCM_ECU[5B]), PD10 (bidir, see BCM_ECU[4C]), PD11 (bidir, see BCM_ECU[4C]), PD12 (bidir, see BCM_ECU[5C]), PD13 (bidir, see BCM_ECU[4D]), PD14 (bidir, see BCM_ECU[4D]), PD15 (bidir, see BCM_ECU[4D]), PE2 (bidir, see BCM_ECU[4B]), PE3 (bidir, see BCM_ECU[4B]), PE4 (bidir, see BCM_ECU[5C]), PE5 (bidir, see BCM_ECU[4B]), PE6 (bidir, see BCM_ECU[4B]), PE7 (bidir, see BCM_ECU[5A]), PE8 (bidir, see BCM_ECU[4C]), PE9 (bidir, see BCM_ECU[5C]), PE10 (bidir, see BCM_ECU[4B]), PE11 (bidir, see BCM_ECU[4B]), PE12 (bidir, see BCM_ECU[4B]), PE13 (bidir, see BCM_ECU[4B]), PE14 (bidir, see BCM_ECU[4A]), PE15 (bidir, see BCM_ECU[4A])

### Nets
3V3: C22.2 C24.1 C25.1 C26.1 C27.1 C28.1 C29.1 C36.1 C37.1 D4.2(A) D4.3(A) D5.2(A) D5.3(A) FB1.1 J4.1 R38.2 R42.1 SW2.2 U10.6(VBAT) U10.11(VDD) U10.27(VDD) U10.50(VDD) U10.75(VDD) U10.100(VDD)
GND: C18.2 C19.2 C20.2 C21.2 C23.2 C24.2 C25.2 C26.2 C27.2 C28.2 C29.2 C30.2 C31.2 C32.2 C33.2 C34.2 C35.2 C36.2 C37.2 C38.2 C39.2 J4.3 J4.5 R41.1 R45.1 SW3.2 U10.10(VSS) U10.19(VSSA) U10.26(VSS) U10.49(VSS) U10.74(VSS) U10.99(VSS) Y1.2(GND) Y1.4(GND)
ADC_MISO: U10.30(PA6) ; port PA6
ADC_MOSI: U10.31(PA7) ; port PA7
ADC_nCS: U10.64(PC7) ; port PC7
ADC_nCS: U10.65(PC8) ; port PC8  [a separate net that carries the same name]
ADC_nCS: U10.28(PA4) ; port PA4  [a separate net that carries the same name]
ADC_nCS: U10.56(PD9) ; port PD9  [a separate net that carries the same name]
ADC_SCLK: U10.29(PA5) ; port PA5
BOOT: C22.1 R39.1 R41.2 U10.94(BOOT0)
CAN_MISO: U10.4(PE5) ; port PE5
CAN_MOSI: U10.5(PE6) ; port PE6
CAN_nCS: U10.2(PE3) ; port PE3
CAN_RX: U10.95(PB8) ; port PB8
CAN_SCLK: U10.1(PE2) ; port PE2
CAN_TX: U10.96(PB9) ; port PB9
G_LED: R43.1 U10.97(PE0)
IO_CHKR_SCL: U10.92(PB6) ; port PB6
IO_CHKR_SDA: U10.93(PB7) ; port PB7
nPWR_FLT_LED: R46.1 ; port nPWR_FLT_LED
R_LED: R44.1 U10.98(PE1)
RESETN: C23.1 J4.10 R40.1 R42.2 U10.14(~{RST})
SD_CLK: U10.80(PC12) ; port PC12
SD_CMD: U10.83(PD2) ; port PD2
SD_DAT0: U10.52(PB13) ; port PB13
SD_DAT1: U10.66(PC9) ; port PC9
SD_DAT2: U10.78(PC10) ; port PC10
SD_DAT3: U10.79(PC11) ; port PC11
SWCLK: J4.4 R38.1 U10.76(PA14)
SWDIO: J4.2 U10.72(PA13)
SWO: J4.6 U10.89(PB3)
VDDA: C30.1 C31.1 C38.1 C39.1 FB1.2 U10.20(VREF+) U10.21(VDDA)
X32_N: C21.1 U10.9(PC15-OSC32_OUT) Y2.2(Out/In)
X32_P: C20.1 U10.8(PC14-OSC32_IN) Y2.1(In/Out)
X_N: C18.1 U10.13(PH1-OSC_OUT) Y1.1
X_P: C19.1 U10.12(PH0-OSC_IN) Y1.3
NetC32_1: C32.1 C33.1 U10.48(VCAP)
NetC34_1: C34.1 C35.1 U10.73(VCAP)
NetC44_2: U10.63(PC6) ; port PC6
NetD4_1: D4.1(K) R43.2
NetD4_4: D4.4(K) R44.2
NetD5_1: D5.1(K) R45.2
NetD5_4: D5.4(K) R46.2
NetR1_MOSFET_BANK_0_1: U10.36(PB2) ; port PB2
NetR1_MOSFET_BANK_1_1: U10.25(PA3) ; port PA3
NetR1_MOSFET_BANK_2_1: U10.87(PD6) ; port PD6
NetR1_MOSFET_BANK_3_1: U10.77(PA15) ; port PA15
NetR2_MOSFET_BANK_0_1: U10.35(PB1) ; port PB1
NetR2_MOSFET_BANK_1_1: U10.23(PA1) ; port PA1
NetR2_MOSFET_BANK_2_1: U10.85(PD4) ; port PD4
NetR2_MOSFET_BANK_3_1: U10.70(PA11) ; port PA11
NetR3_MOSFET_BANK_0_1: U10.33(PC5) ; port PC5
NetR3_MOSFET_BANK_1_1: U10.22(PA0) ; port PA0
NetR3_MOSFET_BANK_2_1: U10.84(PD3) ; port PD3
NetR3_MOSFET_BANK_3_1: U10.69(PA10) ; port PA10
NetR4_MOSFET_BANK_0_1: U10.32(PC4) ; port PC4
NetR4_MOSFET_BANK_1_1: U10.15(PC0) ; port PC0
NetR4_MOSFET_BANK_2_1: U10.81(PD0) ; port PD0
NetR4_MOSFET_BANK_3_1: U10.67(PA8) ; port PA8
NetR5_MOSFET_BANK_0_1: U10.37(PE7) ; port PE7
NetR5_MOSFET_BANK_1_1: U10.24(PA2) ; port PA2
NetR5_MOSFET_BANK_2_1: U10.86(PD5) ; port PD5
NetR5_MOSFET_BANK_3_1: U10.71(PA12) ; port PA12
NetR6_MOSFET_BANK_0_1: U10.34(PB0) ; port PB0
NetR6_MOSFET_BANK_1_1: U10.16(PC1) ; port PC1
NetR6_MOSFET_BANK_2_1: U10.82(PD1) ; port PD1
NetR6_MOSFET_BANK_3_1: U10.68(PA9) ; port PA9
NetR9_2: U10.59(PD12) ; port PD12
NetR10_2: U10.53(PB14) ; port PB14
NetR26_1: U10.38(PE8) ; port PE8
NetR36_1: U10.3(PE4) ; port PE4
NetR39_2: R39.2 SW2.1
NetR40_2: R40.2 SW3.1
NetR50_PWR_PROT_1_2: U10.44(PE14) ; port PE14
NetR50_PWR_PROT_2_2: U10.40(PE10) ; port PE10
NetR50_PWR_PROT_3_2: U10.41(PE11) ; port PE11
NetR50_PWR_PROT_4_2: U10.42(PE12) ; port PE12
NetR50_PWR_PROT_5_2: U10.43(PE13) ; port PE13
NetR70_2: U10.46(PB10) ; port PB10
NetR71_2: U10.39(PE9) ; port PE9
NetR87_2: U10.47(PB11) ; port PB11
NetR88_2: U10.51(PB12) ; port PB12
NetR107_2: U10.45(PE15) ; port PE15
NetR121_IO_CHECKER_0_1: U10.62(PD15) ; port PD15
NetR121_IO_CHECKER_1_1: U10.88(PD7) ; port PD7
NetU10_7: U10.7(PC13) ; port PC13
NetU10_17: U10.17(PC2_C) ; port PC2
NetU10_18: U10.18(PC3_C) ; port PC3
NetU10_54: U10.54(PB15) ; port PB15
NetU10_55: U10.55(PD8) ; port PD8
NetU10_57: U10.57(PD10) ; port PD10
NetU10_58: U10.58(PD11) ; port PD11
NetU10_60: U10.60(PD13) ; port PD13
NetU10_61: U10.61(PD14) ; port PD14
NetU10_90: U10.90(PB4) ; port PB4
NetU10_91: U10.91(PB5) ; port PB5

Not connected (* = marked no-connect by the designer): J4 7* 8* 9*

### Layout directives
differential pair: X32_N, X32_P, X_N, X_P

### Notes on the sheet
- Crystals
- Debug interface
- (near J4) 10-pin JTAG header (J-link EDU compatible)
- Boot switch
- Reset switch
- added 100n cap here
- Status LEDs
- disconnected 3V3 and added TPs
- CHANGED VDDA

### Library data of the parts
C18-C39 = CMP-001-00058-1: LARGE PADS, 0402 CAP, CHANGE COMMENT TO MATCH REAL P/N; Capacitor Type: Ceramic; Min Operating Temperature: -55°C; Mounting Technology: Surface Mount; Pins: 2; Case/Package: 0402; RoHS Compliant: Yes; Max Operating Temperature: 85°C
D4 D5 = CMP-004-00040-2: Led, Red/Grn, 180Mcd/230Mcd, 624Nm/525Nm Rohs Compliant: Yes; Source: rgled.SchLib; Component Type: Standard; Design Item ID: CMP-004-00034-2; Pins: 4
FB1 = CMP-0686-00252-4: Chip Ferrite Bead, 0402, 600Ω @ 100MHz, 0.23Ω, 25%, 900mA; Number of Circuits: 1; Impedance: 600R; DC Resistance (DCR): 230mR; Material: Steel; Length: 1mm; Package Quantity: 10000; Height: 0.5mm; Width: 0.5mm; Max DC Current: 900mA; Number of Lines: 1; Termination: SMD/SMT; Packaging: Tape and Reel; Lead Free: Lead Free; Min Operating Temperature: -55°C; Max Operating Temperature: 125°C; Max Current Rating: 900mA; Case Code (Imperial): 0402; Number of Pins: 2; Current Rating: 900mA; Test Frequency: 100MHz; Case/Package: 0402; Tolerance: 25%; Case Code (Metric): 1005
J4 = CMP-001-0013-3: CONN HEADER SMD 10POS 1.27MM
R38-R40 R43-R46 = CMP-009-00002-14: Resistor
  R38: Value: 10k
  R39 R40 R43-R46: Value: 330
R41 R42 = CMP-009-00002-14: Resistor; Value: 10k
SW2 SW3 = CMP-10040-000029-1: SWITCH TACTILE SPST-NO 0.02A 15V; Operating Force: 240gf; Switch Travel: 0.13mm; Illumination Type: Non-Illuminated; Throw Configuration: SPST; Number of Ports: 1; Current Rating: 5A; Mechanical Life: 500000Cycles; Switch Function: Off-Mom; Connector Type: USB; Actuator Type: Standard; Gender: Receptacle; Number of Contacts: 24; Contact Plating: Gold; Insulation Color: Black; Min Operating Temperature: -40°C; Packaging: Tape and Reel; Flammability Rating: UL94 V-0; Max Operating Temperature: 85°C; Termination: Solder; Mount: Surface Mount
U10 = CMP-12105-000107-1: IC MCU 32BIT 128KB FLASH 100LQFP
Y1 = CMP-2000-05733-3: Crystal 25MHz ±20ppm (Tol) ±30ppm (Stability) 18pF FUND 60Ω 4-Pin SMD T/R; Series Resistance: 60R; Length: 3.2mm; Depth: 2.5mm; Packaging: Tape and Reel; Min Operating Temperature: -40°C; Operating Frequency: 25 MHz; Lead Free: Lead Free; Number of Pins: 4; Frequency Tolerance: 20ppm; Radiation Hardening: No; Max Operating Temperature: 85°C; Termination: SMD/SMT; Frequency Stability: 30ppm; Frequency: 25MHz; Series: ABM8G; Mount: Surface Mount; Package Quantity: 1000; Height: 0.039inch; Width: 0.098inch; Case/Package: CSMD; ESR (Equivalent Series Resistance): 60R; Load Capacitance: 18pF; Tolerance: 20ppm
Y2 = CMP-40224-000006-1: CRYSTAL 32.7680KHZ 12.5PF SMD; Manufacturer: ECS International; Frequency: 32.768kHz; Esr: 90kΩ; Tolerance: 20ppm; Device Class L1: Passive Components; Load Capacitance: 12.5pF; Temperature: -40°C to +85°C; ComponentLink2URL: https://ecsxtal.com/store/pdf/ECX-1210.pdf; Series: ECX-1210; Octopart: https://octopart.com/ecs-.327-12.5-1210-tr-ecs+international-81221340; ComponentLink2Description: Datasheet; Temperature Range Low: -40°C; Digikey Description: CRYSTAL 32.7680KHZ 12.5PF SMD; Lead Free: Yes; RoHS: TRUE; Device Class L3: Crystals; Automotive: No; Category: Crys; Height: 0.5mm; Manufacturer Part Number: ECS-.327-12.5-1210-TR; Temperature Range High: +85°C; Device Class L2: Crystals / Oscillators; Package: ECX-1210

## Sheet TCAN1146_PWR_MGMT.SchDoc
size C; SheetNumber: 3; SheetTotal: 15
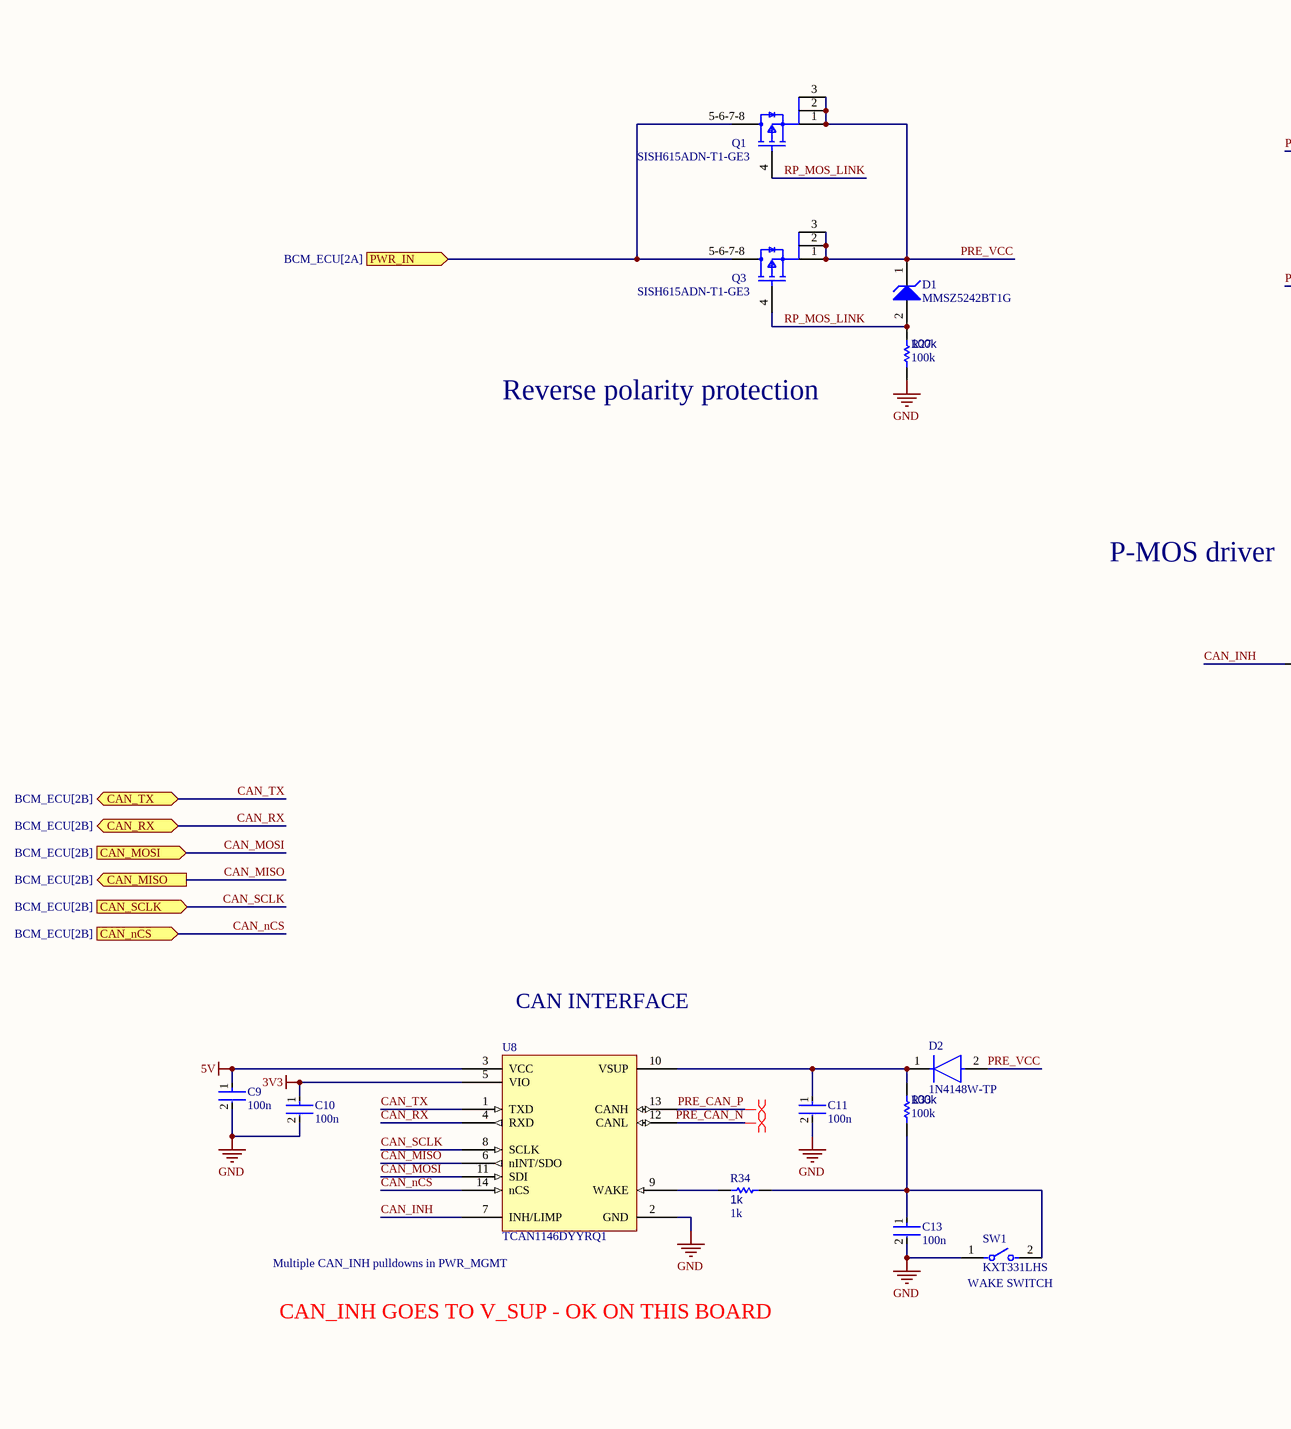
[diagram p5: TCAN1146_PWR_MGMT.SchDoc, left]
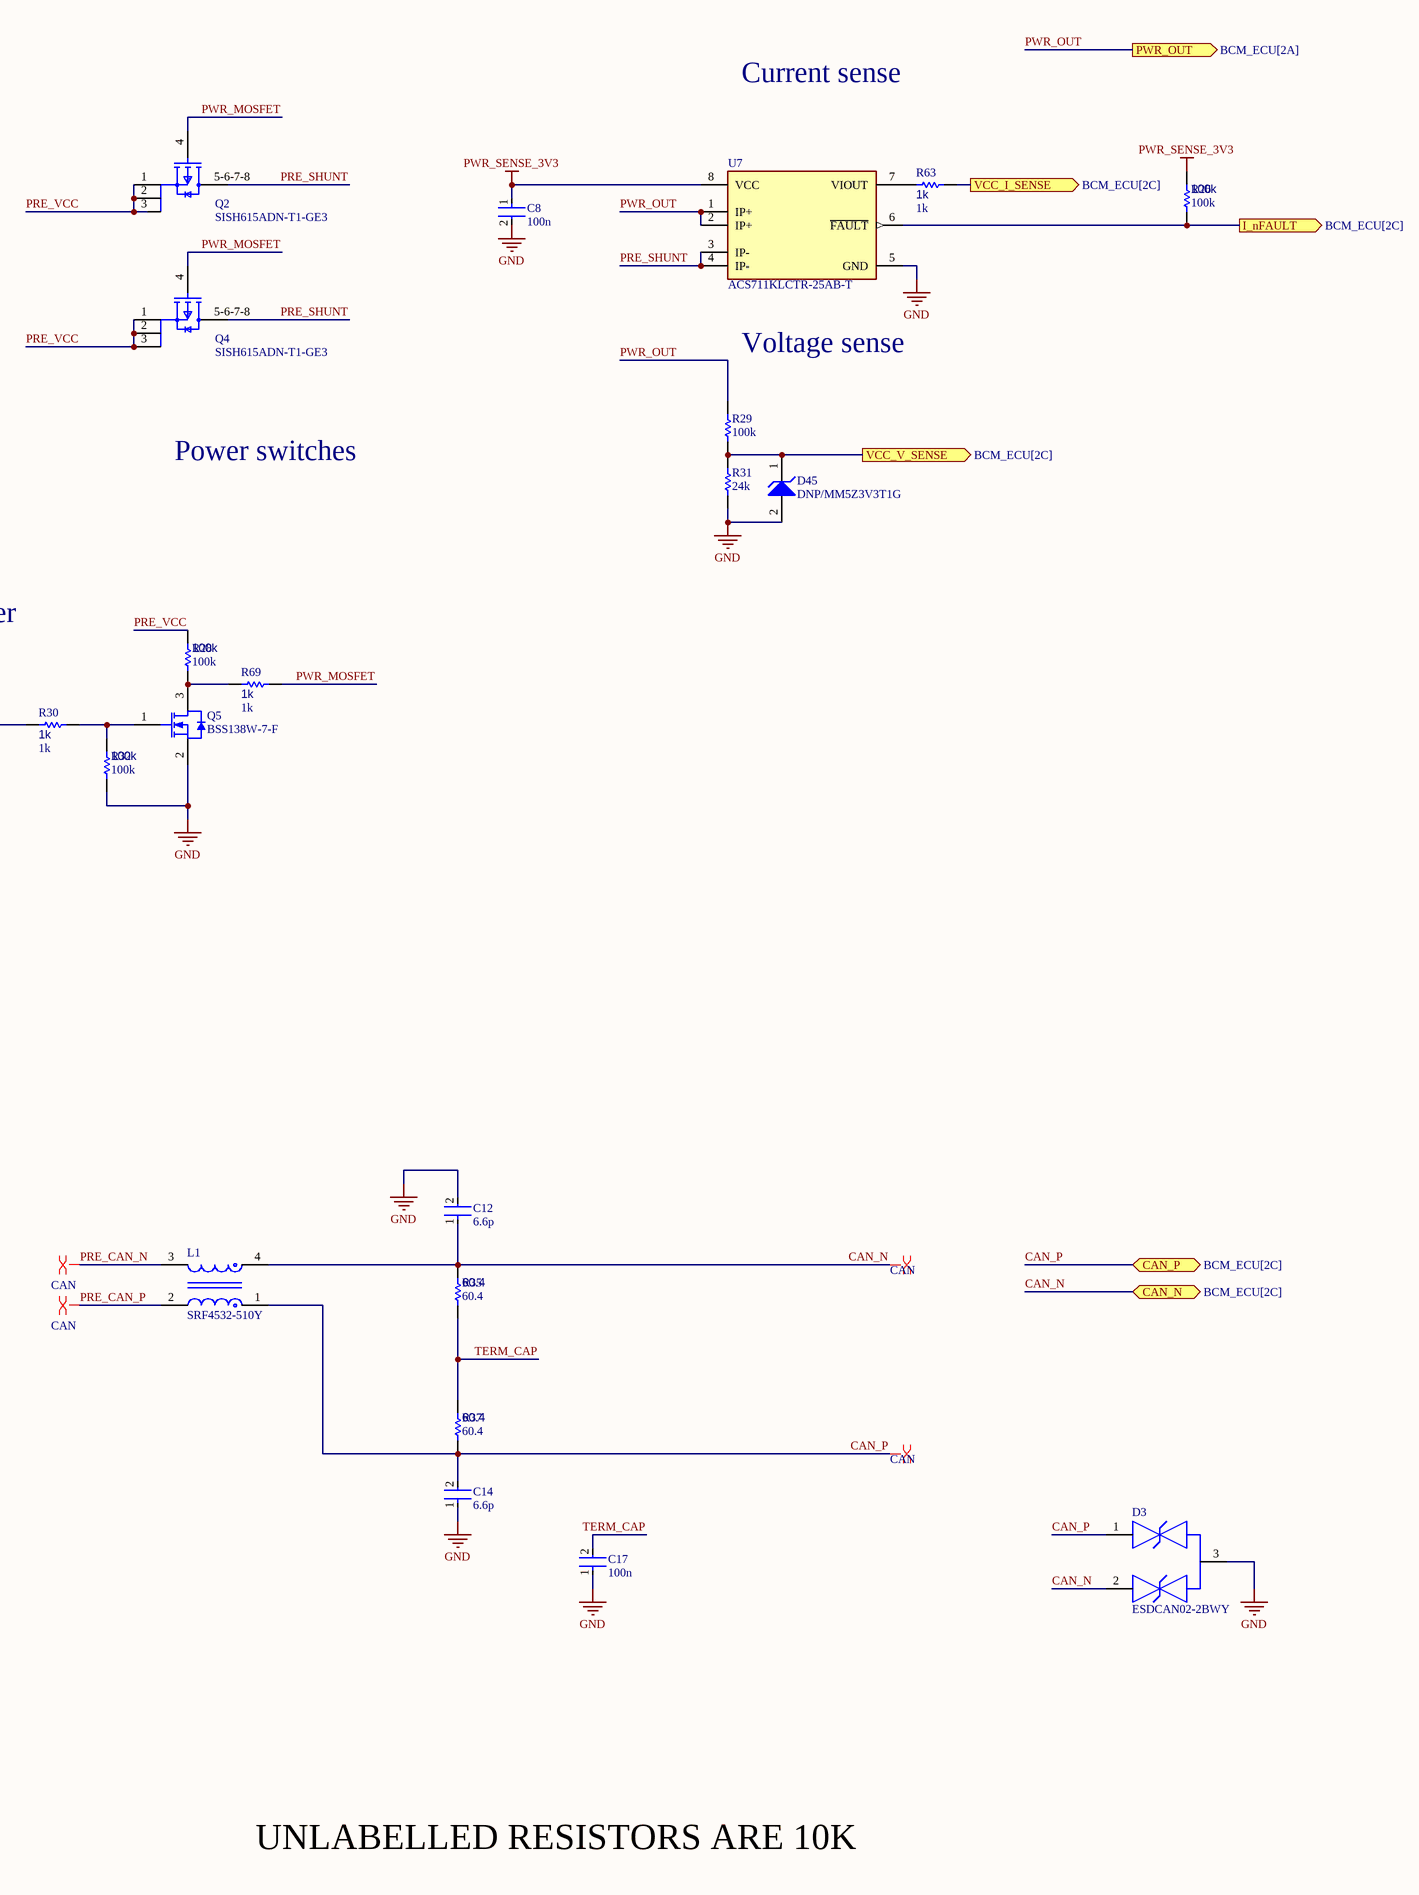
[diagram p6: TCAN1146_PWR_MGMT.SchDoc, right]

### Parts
C8  100n  [FP-0402-L_1_0_0_05-W_0_5-IPC_A]
C9  100n  [FP-0402-L_1_0_0_05-W_0_5-IPC_A]
C10  100n  [FP-0402-L_1_0_0_05-W_0_5-IPC_A]
C11  100n  [FP-0402-L_1_0_0_05-W_0_5-IPC_A]
C12  6.6p  [FP-0402-L_1_0_0_05-W_0_5-IPC_A]
C13  100n  [FP-0402-L_1_0_0_05-W_0_5-IPC_A]
C14  6.6p  [FP-0402-L_1_0_0_05-W_0_5-IPC_A]
C17  100n  [FP-0402-L_1_0_0_05-W_0_5-IPC_A]
D1  MMSZ5242BT1G  [ONSC-SOD-123-2-425-04_V]
D2  1N4148W-TP  [FP-SOD-123-IPC_A]
D3  ESDCAN02-2BWY  [FP-SOT323-3L-MFG]
D45  DNP/MM5Z3V3T1G  [ONSC-SOD-523-2-502-01_V]
L1  SRF4532-510Y  [FP-SRF4532-MFG]
Q1  SISH615ADN-T1-GE3  [SISH615ADN-T1-GE3-Footprint-1]
Q2  SISH615ADN-T1-GE3  [SISH615ADN-T1-GE3-Footprint-1]
Q3  SISH615ADN-T1-GE3  [SISH615ADN-T1-GE3-Footprint-1]
Q4  SISH615ADN-T1-GE3  [SISH615ADN-T1-GE3-Footprint-1]
Q5  BSS138W-7-F  [DIOD-SOT323-3_V]
R26  100k  [R0603B]
R27  100k  [R0603B]
R28  100k  [R0603B]
R29  100k  [R0603B]
R30  1k  [R0603B]
R31  24k  [R0603B]
R32  100k  [R0603B]
R33  100k  [R0603B]
R34  1k  [R0603B]
R35  60.4  [R0603B]
R37  60.4  [R0603B]
R63  1k  [R0603B]
R69  1k  [R0603B]
SW1  KXT331LHS  [FP-KXT331LHS-MFG]
U7  ACS711KLCTR-25AB-T  [FP-LC-8-IPC_A]
U8  TCAN1146DYYRQ1  [TCAN1146DYYRQ1-Footprint-1]

### Ports
CAN_MISO (out, see BCM_ECU[2B]), CAN_MOSI (in, see BCM_ECU[2B]), CAN_N (bidir, see BCM_ECU[2C]), CAN_nCS (in, see BCM_ECU[2B]), CAN_P (bidir, see BCM_ECU[2C]), CAN_RX (bidir, see BCM_ECU[2B]), CAN_SCLK (in, see BCM_ECU[2B]), CAN_TX (bidir, see BCM_ECU[2B]), I_nFAULT (out, see BCM_ECU[2C]), PWR_IN (in, see BCM_ECU[2A]), PWR_OUT (out, see BCM_ECU[2A]), VCC_I_SENSE (out, see BCM_ECU[2C]), VCC_V_SENSE (out, see BCM_ECU[2C])

### Nets
3V3: C10.1 U8.5(VIO)
5V: C9.1 U8.3(VCC)
GND: C8.2 C9.2 C10.2 C11.2 C12.2 C13.2 C14.1 C17.1 D3.3 D45.2(A) Q5.2(S) R27.1 R31.1 R32.1 SW1.1 U7.5(GND) U8.2(GND)
PWR_OUT: R29.2 U7.1(IP+) U7.2(IP+) ; port PWR_OUT
PWR_SENSE_3V3: C8.1 R26.2 U7.8(VCC)
CAN_INH: R30.1 U8.7(INH/LIMP)
CAN_MISO: U8.6(nINT/SDO) ; port CAN_MISO
CAN_MOSI: U8.11(SDI) ; port CAN_MOSI
CAN_N: C12.1 D3.2 L1.4 R35.2 ; port CAN_N
CAN_nCS: U8.14(nCS) ; port CAN_nCS
CAN_P: C14.2 D3.1 L1.1 R37.1 ; port CAN_P
CAN_RX: U8.4(RXD) ; port CAN_RX
CAN_SCLK: U8.8(SCLK) ; port CAN_SCLK
CAN_TX: U8.1(TXD) ; port CAN_TX
MAIN_I_SENSE: R63.1 ; port VCC_I_SENSE
MAIN_V_SENSE: D45.1(K) R29.1 R31.2 ; port VCC_V_SENSE
PRE_CAN_N: L1.3 U8.12(CANL)
PRE_CAN_P: L1.2 U8.13(CANH)
PRE_SHUNT: Q2.5-6-7-8(D) Q4.5-6-7-8(D) U7.3(IP-) U7.4(IP-)
PRE_VCC: D1.1(K) D2.2(A) Q1.1(S) Q1.2(S) Q1.3(S) Q2.1(S) Q2.2(S) Q2.3(S) Q3.1(S) Q3.2(S) Q3.3(S) Q4.1(S) Q4.2(S) Q4.3(S) R28.2
PWR_MOSFET: Q2.4(G) Q4.4(G) R69.2
RP_MOS_LINK: D1.2(A) Q1.4(G) Q3.4(G) R27.2
TERM_CAP: C17.2 R35.1 R37.2
NetC11_1: C11.1 D2.1(C) R33.2 U8.10(VSUP)
NetC13_1: C13.1 R33.1 R34.2 SW1.2
NetQ1_5-6-7-8: Q1.5-6-7-8(D) Q3.5-6-7-8(D) ; port PWR_IN
NetQ5_1: Q5.1(G) R30.2 R32.2
NetQ5_3: Q5.3(D) R28.1 R69.1
NetR26_1: R26.1 U7.6(~{FAULT}) ; port I_nFAULT
NetR34_1: R34.1 U8.9(WAKE)
NetR63_2: R63.2 U7.7(VIOUT)

### Layout directives
differential pair: PRE_CAN_N, PRE_CAN_P
differential pair; differential pair class CAN: CAN_N, CAN_P, PRE_CAN_N, PRE_CAN_P

### Notes on the sheet
- Current sense
- Voltage sense
- (near R27) Reverse polarity protection
- Power switches
- P-MOS driver
- CAN INTERFACE
- (near U8) Multiple CAN_INH pulldowns in PWR_MGMT
- (near SW1) WAKE SWITCH
- CAN_INH GOES TO V_SUP - OK ON THIS BOARD
- UNLABELLED RESISTORS ARE 10K

### Library data of the parts
C8-C14 C17 = CMP-001-00058-1: as C18 on sheet STM32H730_PINOUT; Min Operating Temperature: -55°C; Mounting Technology: Surface Mount; Pins: 2; Case/Package: 0402; RoHS Compliant: Yes; Max Operating Temperature: 85°C
D1 = CMP-1060-00565-1: Zener Voltage Regulator, 500 mW, 2-Pin SOD-123, Pb-Free, Tape and Reel; Manufacturer: On Semiconductor; P Max (W): 0.5; VZ Typ (V): 12; PartNumber: MMSZ5242BT1G; PackageReference: SOD-123-2-425-04; ComponentLink3URL: http://www.onsemi.com/pub_link/Collateral/425-04.PDF; Mounting Technology: Surface Mount; ComponentLink2Description: Datasheet; ComponentLink1URL: http://www.onsemi.com/; ComponentLink3Description: Package Specification; PackageDescription: 2-Pin SOD, Body 1.6 x 2.69 mm; PackageVersion: Rev. G, 10/2009; ComponentLink1Description: Manufacturer URL; RoHS: Pb-Free; ComponentLink2URL: http://www.onsemi.com/pub_link/Collateral/MMSZ5221BT1-D.PDF; Packing: Tape and Reel; DatasheetVersion: Rev. 12
D2 = CMP-2000-04993-2: DIODE GEN PURP 100V 150MA SOD123; Max Reverse Leakage Current: 5uA; Max Surge Current: 2A; Reverse Recovery Time: 4ns; Polarity: Standard; Capacitance: 4pF; Max Forward Surge Current (Ifsm): 1A; Element Configuration: Single; Power Dissipation: 400mW; Forward Voltage: 1V; Radiation Hardening: No; Lead Free: Lead Free; Max Reverse Voltage (DC): 100V; Current Rating: 150mA; Forward Current: 150mA; Packaging: Tape and Reel; Number of Pins: 2; Package Quantity: 3000; Max Operating Temperature: 150°C; Min Operating Temperature: -65°C; Average Rectified Current: 150mA; Recovery Time: 4ns; Output Current: 150mA; Peak Non-Repetitive Surge Current: 2A; Width: 1.8mm; Voltage Rating (DC): 100V; Height: 1.2mm; Max Repetitive Reverse Voltage (Vrrm): 100V; Mount: Surface Mount; Length: 2.85mm
D3 = CMP-12225-000055-1: TVS DIODE 26.5V 44V SOT323-3; Manufacturer: STMicroelectronics; Value: 3pF; Direction: Bidirectional; Breakdown Voltage: 28.5V; Automotive Grade: Grade 0; Standoff Height: 0mm; Peak Pulse Power: 170W; Peak Pulse Current: 3A; Number Of Channels: 2; Max Junction Temp: +175°C; Mouser Description: TVS Diodes / ESD Suppressors Automotive dual-line Transil, Transient voltage suppressor (TVS) for CAN bus; Height: 1.1mm; Category: Diode; Reverse Standoff Voltage: 26.5V; Device Class L1: Circuit Protection; Temperature: -55°C to +175°C; RoHS: TRUE; ComponentLink2URL: https://www.st.com/resource/en/datasheet/esdcan02-2bwy.pdf; Device Class L3: unset; Device Class L2: TVS Diodes; Temperature Range High: +175°C; Octopart: https://octopart.com/esdcan02-2bwy-stmicroelectronics-58631133; Ipc Land Pattern Name: SOT65P210X95-3; Temperature Range Low: -55°C; Capacitance: 3pF; Digikey Description: TVS DIODE 26.5V 44V SOT323-3; Automotive: Yes; ComponentLink2Description: Datasheet; Clamping Voltage: 44V; Manufacturer Part Number: ESDCAN02-2BWY; Lead Free: Yes; Package: SOT323-3L
D45 = CMP-1060-00750-1: Zener Voltage Regulator, 500 mW, 2-Pin SOD-523, Pb-Free, Tape and Reel; Manufacturer: On Semiconductor; P Max (W): 0.5; VZ Typ (V): 3.3; RoHS: Pb-Free; ComponentLink2Description: Datasheet; PackageReference: SOD-523-2-502-01; DatasheetVersion: Rev. 10; ComponentLink1Description: Manufacturer URL; PackageVersion: Rev. E, 09/2010; ComponentLink3URL: http://www.onsemi.com/pub_link/Collateral/502-01.PDF; ComponentLink2URL: http://www.onsemi.cn/pub_link/Collateral/MM5Z2V4T1-D.PDF; Mounting Technology: Surface Mount; PartNumber: MM5Z3V3T1G; Packing: Tape and Reel; PackageDescription: 2-Pin SOD, Body 1.2 x 0.8 mm; ComponentLink1URL: http://www.onsemi.com/; ComponentLink3Description: Package Specification
L1 = CMP-07251-000006-1: CMC 51UH 200MA 2LN 2KOHM SMD; Element Configuration: Dual; Number of Lines: 2; Core Material: Ferrite; Impedance: 2kR; Test Frequency: 100kHz; Voltage Rating (DC): 50V; Insulation Resistance: 10MR; Material: Steel; Tolerance: 50%; DC Resistance (DCR): 3.5R; RoHS Compliant: Yes; Mount: Surface Mount; REACH SVHC: No SVHC; Termination: SMD/SMT; DC Current: 200mA; Current: 200mA; Lead Free: Lead Free; Contact Plating: Tin; Length: 4.5mm; Max DC Current: 200mA; Width: 0.126inch; Case/Package: 4532; Packaging: Tape and Reel; Package Quantity: 1; Min Operating Temperature: -40°C; Depth: 3.4mm; Series: SRF4532; Max Operating Temperature: 125°C; Current Rating: 200mA; Self Resonant Frequency: 100kHz; Height: 0.118inch; Inductance: 51uH; Resistance: 2kR
Q1-Q4 = CMP-013-00018-2: Trans MOSFET P-CH 20V 22.1A 8-Pin PowerPAK 1212 EP T/R; Source: SISH615ADN-T1-GE3.SchLib; Design Item ID: CMP-013-00036-4; Component Type: Standard; Pins: 5
Q5 = CMP-2000-05968-1: N-Channel Enhancement Mode Mosfet, 50 V, 200 mA, -55 to 150 degC, 6-Pin SOT-323, RoHS, Tape and Reel; Typical Turn-Off Delay Time: 20ns; Number of Channels: 1Channel; Type: EnhancementModeFieldEffectTransistor; Brand: DiodesIncorporated; Vds - Drain-Source Breakdown Voltage: 75V; Vgs - Gate-Source Voltage: 20V; Rds On - Drain-Source Resistance: 1.4Ohms; Transistor Type: 1N-Channel; Configuration: Single; Unit Weight: 0.000212oz; Pd - Power Dissipation: 200mW; Id - Continuous Drain Current: 200mA; Forward Transconductance - Min: 0.1S; Manufacturer URL: http://www.diodes.com/; Series: BSS138; Package Description: 3-Pin Small Outline Transistor, Body 2 x 1.25 mm, Pitch 0.65 mm; Mounting Technology: SurfaceMount; Product Category: MOSFET; RoHS: True; Maximum Operating Temperature: +150C; Height: 1mm; Length: 2.2mm; Technology: Si; Width: 1.35mm; Datasheet URL: http://www.diodes.com/_files/datasheets/ds30206.pdf; Manufacturer: DiodesIncorporated; Package / Case: SOT-323-3; Typical Turn-On Delay Time: 20ns; Transistor Polarity: N-Channel; Factory Pack Quantity: 3000; Packaging: Reel; Product: MOSFETSmallSignal; Datasheet Version: Rev. 11-2, 09/2013; Package Reference: SOT323; Minimum Operating Temperature: -55C; Mounting Style: SMD/SMT; Channel Mode: Enhancement
R26-R35 R37 R63 R69 = CMP-009-00002-14: Resistor
  R26-R29 R32 R33: Value: 100k
  R30 R34 R63 R69: Value: 1k
  R31: Value: 24k
  R35 R37: Value: 60.4
SW1 = CMP-10040-000029-1: as SW2 on sheet STM32H730_PINOUT; Contact Plating: Gold; Insulation Color: Black; Min Operating Temperature: -40°C; Packaging: Tape and Reel; Flammability Rating: UL94 V-0; Max Operating Temperature: 85°C; Termination: Solder; Mount: Surface Mount
U7 = CMP-1557-00015-2: SENSOR CURRENT HALL 25A AC/DC; Bandwidth: 100kHz; Min Supply Voltage: 3V; Polarity: Bidirectional; Max Supply Voltage: 5.5V; Max Supply Current: 5.5mA; Number of Channels: 1; Quiescent Current: 4mA; Sensitivity: 55mV/A; Accuracy: 4%; Linearity: 1%; Operating Supply Voltage: 3.3V; Response Time: 4.6us; Case/Package: SOIC; Min Operating Temperature: -40°C; RoHS Compliant: Yes; Length: 4.9mm; Package Quantity: 1; Number of Pins: 8; Width: 3.9mm; REACH SVHC: No SVHC; -3db Bandwidth: 100kHz; Series: -; Packaging: Tape and Reel; Max Operating Temperature: 125°C; Current Sensing: 25A; Height: 1.5mm; Frequency: 100kHz
U8 = CMP-318-000000-2: Automotive CAN FD transceiver with watchdog, bus diagnostics and partial networking via sele 14-SOT-23-THIN -40 to 150; Component Type: Standard; Design Item ID: CMP-015-00012-2; Pin Count: 14; Source: TCAN1146DYYRQ1.SchLib